# Altium project Rad_hard_git.PrjPcb (part 1 of 2)
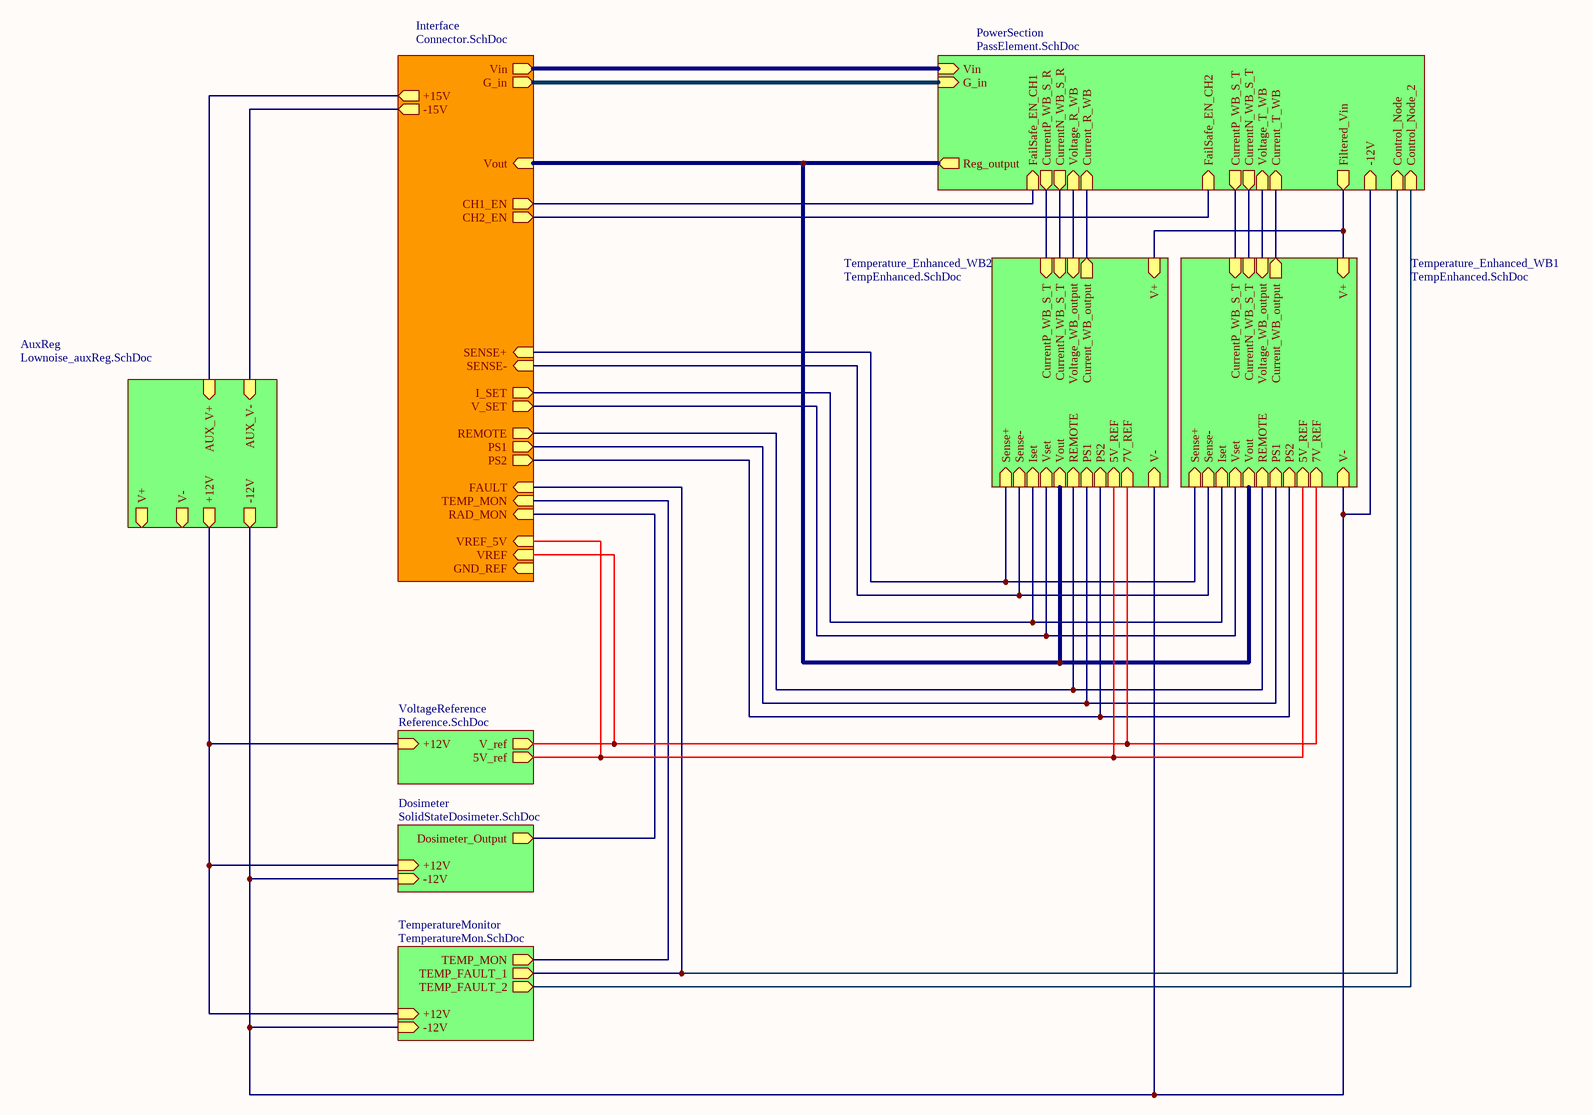
[diagram p0: CoverSchematic.SchDoc]
8 sheets, 183 parts. Net scope: hierarchical (ports join the sheet entries above them; power ports are global).
Board file: radhard.PcbDoc
Sheets:
  CoverSchematic.SchDoc
    Interface = Connector.SchDoc
    PowerSection = PassElement.SchDoc
    VoltageReference = Reference.SchDoc
    Temperature_Enhanced_WB1 = TempEnhanced.SchDoc
    Dosimeter = SolidStateDosimeter.SchDoc
    TemperatureMonitor = TemperatureMon.SchDoc
    AuxReg = Lownoise_auxReg.SchDoc
    Temperature_Enhanced_WB2 = TempEnhanced.SchDoc

## Sheet CoverSchematic.SchDoc
size 431 x 279 mm; SheetNumber: 1; SheetTotal: 8

### Sub-sheets
AuxReg = Lownoise_auxReg.SchDoc: AUX_V+ (in), AUX_V- (in), +12V (out), -12V (out), V+ (out), V- (out)
Dosimeter = SolidStateDosimeter.SchDoc: Dosimeter_Output (out), -12V (in), +12V (in)
Interface = Connector.SchDoc: Vin (out), +15V (out), -15V (out), SENSE- (in), SENSE+ (in), Vout (in), V_SET (out), I_SET (out), CH1_EN (out), CH2_EN (out), FAULT (in), RAD_MON (in), TEMP_MON (in), VREF_5V (in), GND_REF (in), VREF (in), PS2 (out), REMOTE (out), PS1 (out), G_in (out)
PowerSection = PassElement.SchDoc: Vin (in), Reg_output (out), -12V (in), FailSafe_EN_CH1 (in), CurrentP_WB_S_R (out), CurrentN_WB_S_R (out), Voltage_R_WB (in), Current_R_WB (in), FailSafe_EN_CH2 (in), CurrentP_WB_S_T (out), CurrentN_WB_S_T (out), Voltage_T_WB (in), Current_T_WB (in), Filtered_Vin (out), Control_Node (in), Control_Node_2 (in), G_in (in)
Temperature_Enhanced_WB1 = TempEnhanced.SchDoc: V+ (in), V- (in), Voltage_WB_output (in), Current_WB_output (out), CurrentP_WB_S_T (in), CurrentN_WB_S_T (in), Sense+ (in), Sense- (in), Iset (in), Vset (in), 5V_REF (in), 7V_REF (in), Vout (in), REMOTE (in), PS1 (in), PS2 (in)
Temperature_Enhanced_WB2 = TempEnhanced.SchDoc: V+ (in), V- (in), Voltage_WB_output (in), Current_WB_output (out), CurrentP_WB_S_T (in), CurrentN_WB_S_T (in), Sense+ (in), Sense- (in), Iset (in), Vset (in), 5V_REF (in), 7V_REF (in), Vout (in), REMOTE (in), PS1 (in), PS2 (in)
TemperatureMonitor = TemperatureMon.SchDoc: -12V (in), +12V (in), TEMP_FAULT_1 (out), TEMP_MON (out), TEMP_FAULT_2 (out)
VoltageReference = Reference.SchDoc: V_ref (out), 5V_ref (out), +12V (in)

### Nets
Sense+: sheet Interface/SENSE+, sheet Temperature_Enhanced_WB1/Sense+, sheet Temperature_Enhanced_WB2/Sense+
Sense-: sheet Interface/SENSE-, sheet Temperature_Enhanced_WB1/Sense-, sheet Temperature_Enhanced_WB2/Sense-
V+: sheet PowerSection/Filtered_Vin, sheet Temperature_Enhanced_WB1/V+, sheet Temperature_Enhanced_WB2/V+
V-: sheet PowerSection/-12V, sheet Temperature_Enhanced_WB1/V-, sheet Dosimeter/-12V, sheet TemperatureMonitor/-12V, sheet AuxReg/-12V, sheet Temperature_Enhanced_WB2/V-
NetAmph_5: sheet Interface/VREF, sheet VoltageReference/V_ref, sheet Temperature_Enhanced_WB1/7V_REF, sheet Temperature_Enhanced_WB2/7V_REF
NetAmph_7: sheet Interface/VREF_5V, sheet VoltageReference/5V_ref, sheet Temperature_Enhanced_WB1/5V_REF, sheet Temperature_Enhanced_WB2/5V_REF
NetC3_2: sheet Interface/Vout, sheet PowerSection/Reg_output, sheet Temperature_Enhanced_WB1/Vout, sheet Temperature_Enhanced_WB2/Vout
NetC7_2: sheet VoltageReference/+12V, sheet Dosimeter/+12V, sheet TemperatureMonitor/+12V, sheet AuxReg/+12V
NetD1_1: sheet Interface/FAULT, sheet PowerSection/Control_Node, sheet TemperatureMonitor/TEMP_FAULT_1
NetD3_1: sheet Interface/Vin, sheet PowerSection/Vin
NetD5_1: sheet PowerSection/Control_Node_2, sheet TemperatureMonitor/TEMP_FAULT_2
NetD15_1: sheet Interface/+15V, sheet AuxReg/AUX_V+
NetD19_3: sheet Interface/-15V, sheet AuxReg/AUX_V-
NetD27_2: sheet Interface/G_in, sheet PowerSection/G_in
NetJ1_3: sheet Interface/V_SET, sheet Temperature_Enhanced_WB1/Vset, sheet Temperature_Enhanced_WB2/Vset
NetJ1_5: sheet Interface/I_SET, sheet Temperature_Enhanced_WB1/Iset, sheet Temperature_Enhanced_WB2/Iset
NetJ1_8: sheet Interface/CH2_EN, sheet PowerSection/FailSafe_EN_CH2
NetJ1_9: sheet Interface/CH1_EN, sheet PowerSection/FailSafe_EN_CH1
NetJ1_20: sheet Interface/REMOTE, sheet Temperature_Enhanced_WB1/REMOTE, sheet Temperature_Enhanced_WB2/REMOTE
NetJ1_21: sheet Interface/PS1, sheet Temperature_Enhanced_WB1/PS1, sheet Temperature_Enhanced_WB2/PS1
NetJ1_22: sheet Interface/PS2, sheet Temperature_Enhanced_WB1/PS2, sheet Temperature_Enhanced_WB2/PS2
NetJ1_24: sheet Interface/RAD_MON, sheet Dosimeter/Dosimeter_Output
NetJ1_25: sheet Interface/TEMP_MON, sheet TemperatureMonitor/TEMP_MON
NetQ1_3: sheet PowerSection/CurrentP_WB_S_R, sheet Temperature_Enhanced_WB2/CurrentP_WB_S_T
NetQ5_4: sheet PowerSection/CurrentN_WB_S_R, sheet Temperature_Enhanced_WB2/CurrentN_WB_S_T
NetQ6_3: sheet PowerSection/CurrentP_WB_S_T, sheet Temperature_Enhanced_WB1/CurrentP_WB_S_T
NetQ7_4: sheet PowerSection/CurrentN_WB_S_T, sheet Temperature_Enhanced_WB1/CurrentN_WB_S_T
NetR5_1: sheet PowerSection/Current_R_WB, sheet Temperature_Enhanced_WB2/Current_WB_output
NetR6_2: sheet PowerSection/Voltage_R_WB, sheet Temperature_Enhanced_WB2/Voltage_WB_output
NetR13_1: sheet PowerSection/Current_T_WB, sheet Temperature_Enhanced_WB1/Current_WB_output
NetR14_2: sheet PowerSection/Voltage_T_WB, sheet Temperature_Enhanced_WB1/Voltage_WB_output

### Notes on the sheet
- DWG. NO.
- REV.
- SHT.
- THIS DOCUMENT AND THE DATA DISCLOSED HEREIN OR HEREWITH IS THE PROPERTY OF ALTIUM LIMITED AND MAY BE FREELY DISTRIBUTED IN WHOLE. NO RIGHTS ARE RESERVED OR EXPRESS OR IMPLIED WARANTEE GIVEN.
- REVISION
- DESCRIPTION
- DATE
- APPROVED
- TITLE
- PROJECT
- SCALE:
- B
- SIZE
- CAGE CODE
- FILE NAME
- DWG by:
- Heitor Sampaio Mendes
- SHEET
- OF
- REV

## Sheet Connector.SchDoc
size 431 x 279 mm; SheetNumber: 2; SheetTotal: 8
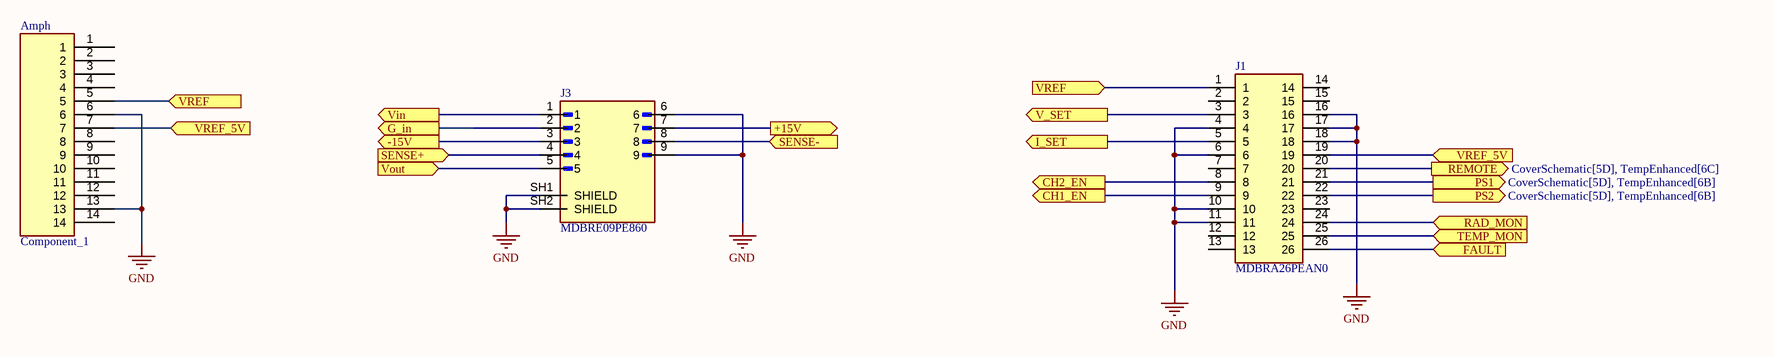
[diagram p1: Connector.SchDoc]

### Parts
Amph  Component_1  [PCBComponent_1]
J1  MDBRA26PEAN0  [MDBRA26PEAN0]
J3  MDBRE09PE860  [AMPHENOL_MDBRE09PE860]

### Ports
+15V (out, see CoverSchematic[6F]), -15V (out, see CoverSchematic[6F]), CH1_EN (out, see CoverSchematic[5E]), CH2_EN (out, see CoverSchematic[5E]), FAULT (in, see CoverSchematic[5D]), G_in (out, see CoverSchematic[5F], PassElement[10D]), I_SET (out, see CoverSchematic[5E]), PS1 (out, see CoverSchematic[5D], TempEnhanced[6B]), PS2 (out, see CoverSchematic[5D], TempEnhanced[6B]), RAD_MON (in, see CoverSchematic[5D]), REMOTE (out, see CoverSchematic[5D], TempEnhanced[6C]), SENSE+ (in, see CoverSchematic[5E], TempEnhanced[8D]), SENSE- (in, see CoverSchematic[5E], TempEnhanced[8D]), TEMP_MON (in, see CoverSchematic[5D], TemperatureMon[4E]), V_SET (out, see CoverSchematic[5E]), Vin (out, see CoverSchematic[5F], PassElement[10E]), Vout (in, see CoverSchematic[5F], TempEnhanced[5C]), VREF (in, see CoverSchematic[5D]), VREF_5V (in, see CoverSchematic[5D])

### Nets
GND: Amph.6 Amph.13 J1.4 J1.6 J1.10 J1.11 J1.16 J1.17 J1.18 J3.6 J3.9 J3.SH1(SHIELD) J3.SH2(SHIELD)
Sense+: J3.4 ; port SENSE+
Sense-: J3.8 ; port SENSE-
NetAmph_5: Amph.5 J1.1 ; port VREF
NetAmph_7: Amph.7 J1.19 ; port VREF_5V
NetC3_2: J3.5 ; port Vout
NetD1_1: J1.26 ; port FAULT
NetD3_1: J3.1 ; port Vin
NetD15_1: J3.7 ; port +15V
NetD19_3: J3.3 ; port -15V
NetD27_2: J3.2 ; port G_in
NetJ1_3: J1.3 ; port V_SET
NetJ1_5: J1.5 ; port I_SET
NetJ1_8: J1.8 ; port CH2_EN
NetJ1_9: J1.9 ; port CH1_EN
NetJ1_20: J1.20 ; port REMOTE
NetJ1_21: J1.21 ; port PS1
NetJ1_22: J1.22 ; port PS2
NetJ1_24: J1.24 ; port RAD_MON
NetJ1_25: J1.25 ; port TEMP_MON

Not connected (* = marked no-connect by the designer): Amph 1 2 3 4 8 9 10 11 12 14; J1 2 7 12 13 14 15 23

### Notes on the sheet
- DWG. NO.
- REV.
- SHT.
- THIS DOCUMENT AND THE DATA DISCLOSED HEREIN OR HEREWITH IS THE PROPERTY OF ALTIUM LIMITED AND MAY BE FREELY DISTRIBUTED IN WHOLE. NO RIGHTS ARE RESERVED OR EXPRESS OR IMPLIED WARANTEE GIVEN.
- REVISION
- DESCRIPTION
- DATE
- APPROVED
- TITLE
- PROJECT
- SCALE:
- B
- SIZE
- CAGE CODE
- FILE NAME
- DWG by:
- Heitor Sampaio Mendes
- SHEET
- OF
- REV

### Library data of the parts
Amph = ACRK-16-01-G-T-B1-M-1
J1 = MDBRA26PEAN0: Connector; Manufacturer_Name: Amphenol Communications Solutions; Datasheet Link: https://cdn.amphenol-cs.com/media/wysiwyg/files/documentation/datasheet/inputoutput/io_harsh_mdbr.pdf; Height: 15.18mm; Manufacturer_Part_Number: MDBRA26PEAN0; Mouser Part Number: 523-MDBRA26PEAN0; Mouser Price/Stock: https://www.mouser.co.uk/ProductDetail/Amphenol-Commercial-Products/MDBRA26PEAN0?qs=ToP8pWlZ0bMfgHuNRziKHA%3D%3D
J3 = MDBRE09PE860: MF: {'manufacturer': u'Amphenol Commercial Products'}; Package: None; Price: None; Value: *; MP: MDBRE09PE860; Availability: Unavailable

## Sheet PassElement.SchDoc
size 558 x 431 mm; SheetNumber: 5; SheetTotal: 8
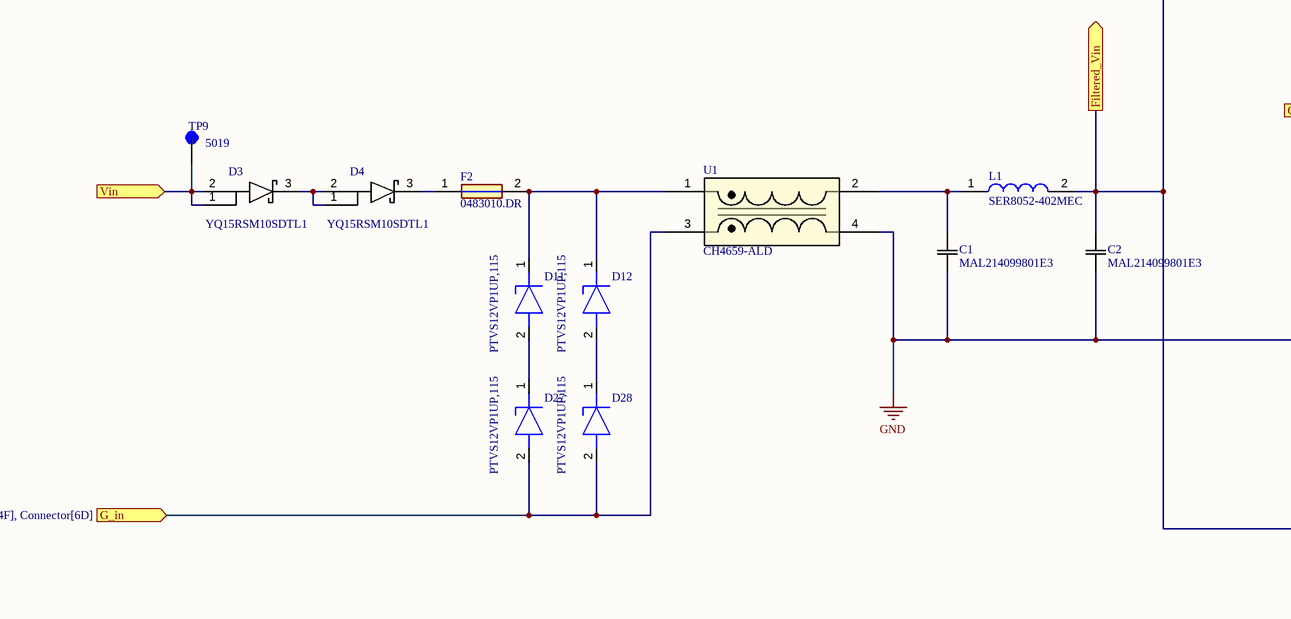
[diagram p2: PassElement.SchDoc, left]
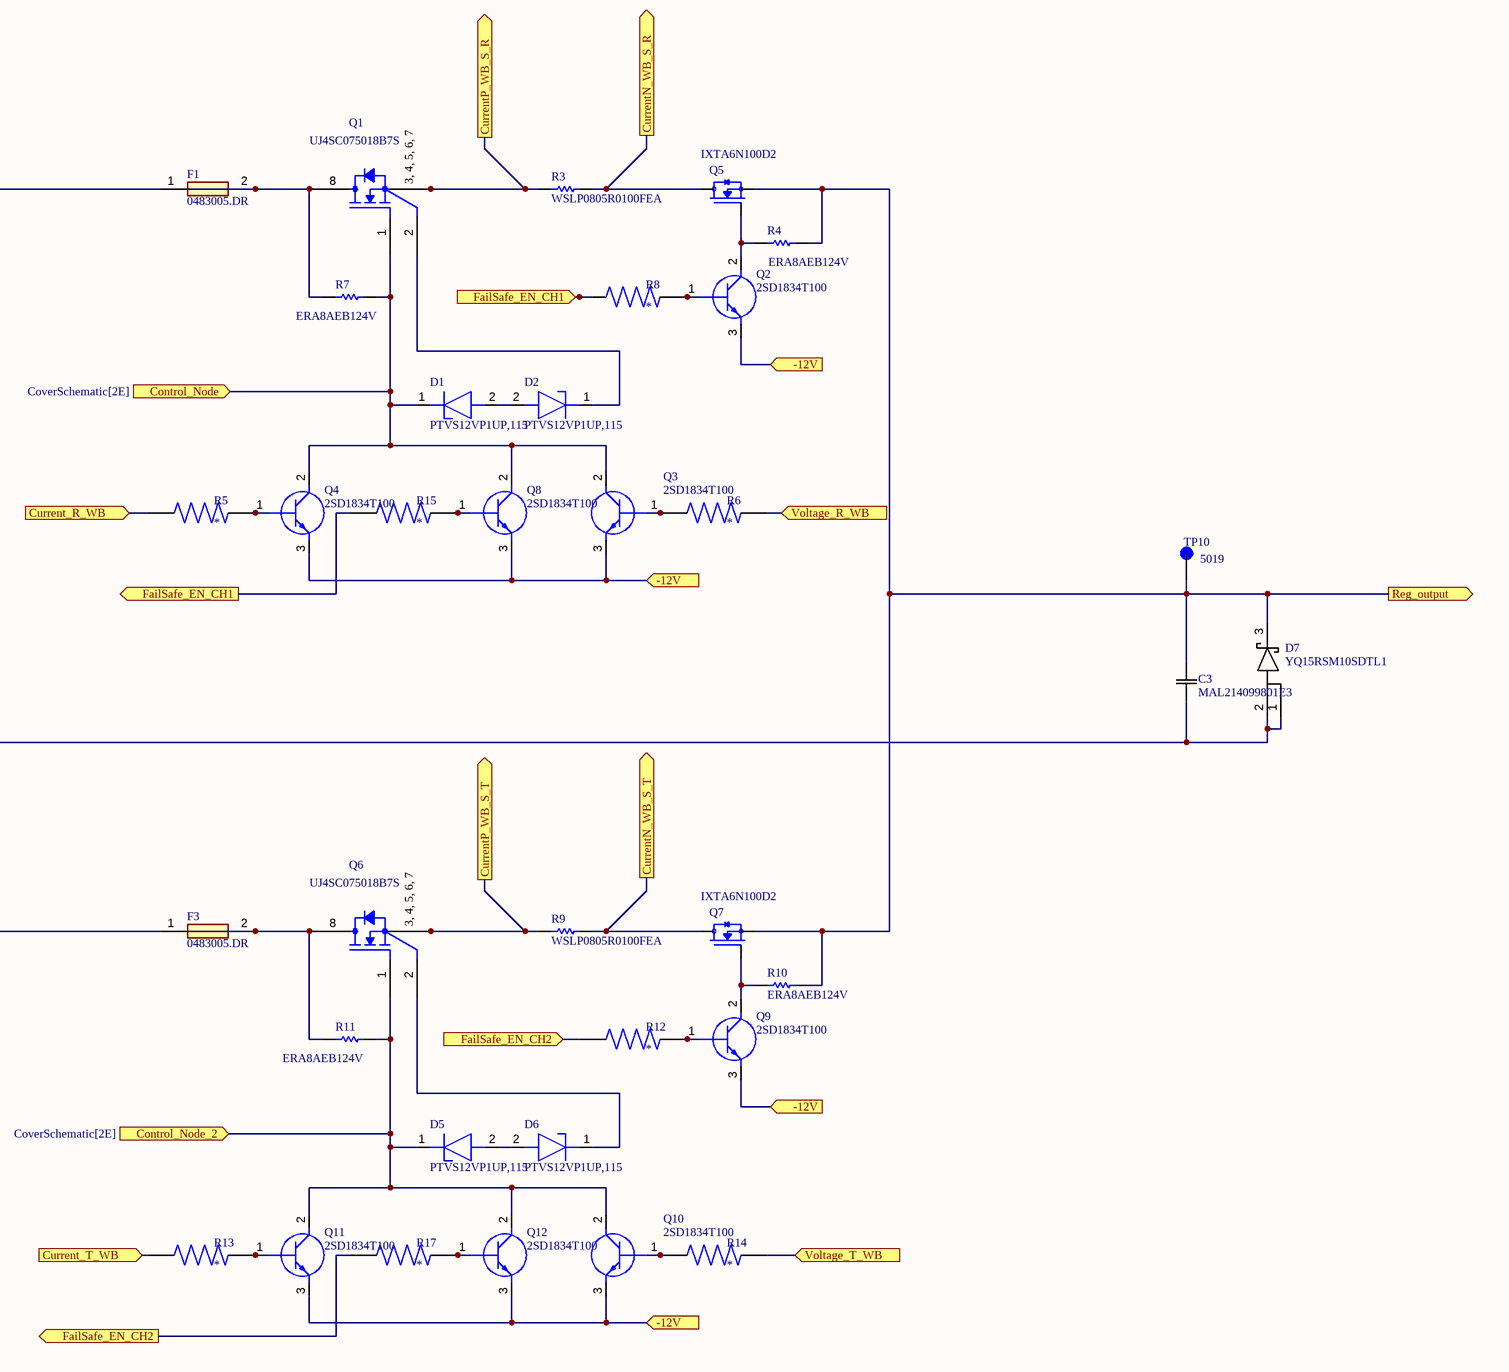
[diagram p3: PassElement.SchDoc, right]

### Parts
C1  MAL214099801E3  [CAP_140CRH_1010_VIS]
C2  MAL214099801E3  [CAP_140CRH_1010_VIS]
C3  MAL214099801E3  [CAP_140CRH_1010_VIS]
D1  PTVS12VP1UP,115  [PMEG3050EP115]
D2  PTVS12VP1UP,115  [PMEG3050EP115]
D3  YQ15RSM10SDTL1  [YQ15RSM10SDTL1]
D4  YQ15RSM10SDTL1  [YQ15RSM10SDTL1]
D5  PTVS12VP1UP,115  [PMEG3050EP115]
D6  PTVS12VP1UP,115  [PMEG3050EP115]
D7  YQ15RSM10SDTL1  [YQ15RSM10SDTL1]
D11  PTVS12VP1UP,115  [PMEG3050EP115]
D12  PTVS12VP1UP,115  [PMEG3050EP115]
D27  PTVS12VP1UP,115  [PMEG3050EP115]
D28  PTVS12VP1UP,115  [PMEG3050EP115]
F1  0483005.DR  [FUSC3316X137N]
F2  0483010.DR  [FUSC3316X137N]
F3  0483005.DR  [FUSC3316X137N]
L1  SER8052-402MEC  [SER8052402MEC]
Q1  UJ4SC075018B7S  [UJ4SC075018B7S]
Q2  2SD1834T100  [RJP020N06]
Q3  2SD1834T100  [RJP020N06]
Q4  2SD1834T100  [RJP020N06]
Q5  IXTA6N100D2  [DPAK254P1524X483-3N]
Q6  UJ4SC075018B7S  [UJ4SC075018B7S]
Q7  IXTA6N100D2  [DPAK254P1524X483-3N]
Q8  2SD1834T100  [RJP020N06]
Q9  2SD1834T100  [RJP020N06]
Q10  2SD1834T100  [RJP020N06]
Q11  2SD1834T100  [RJP020N06]
Q12  2SD1834T100  [RJP020N06]
R3  WSLP0805R0100FEA  [RESC2013X58X38LL25T25]
R4  ERA8AEB124V  [RESC3216X70X50LL20T25]
R5  MCT06030C1001FP500  [RESC1508X55N]  (value not drawn)
R6  MCT06030C1001FP500  [RESC1508X55N]  (value not drawn)
R7  ERA8AEB124V  [RESC3216X70X50LL20T25]
R8  MCT06030C1001FP500  [RESC1508X55N]  (value not drawn)
R9  WSLP0805R0100FEA  [RESC2013X58X38LL25T25]
R10  ERA8AEB124V  [RESC3216X70X50LL20T25]
R11  ERA8AEB124V  [RESC3216X70X50LL20T25]
R12  MCT06030C1001FP500  [RESC1508X55N]  (value not drawn)
R13  MCT06030C1001FP500  [RESC1508X55N]  (value not drawn)
R14  MCT06030C1001FP500  [RESC1508X55N]  (value not drawn)
R15  MCT06030C1001FP500  [RESC1508X55N]  (value not drawn)
R17  MCT06030C1001FP500  [RESC1508X55N]  (value not drawn)
TP9  5019  [KEYSTONE_5019]
TP10  5019  [KEYSTONE_5019]
U1  CH4659-ALD  [CH4659-ALD_COC]

### Ports
-12V (in, see CoverSchematic[3E], Lownoise_auxReg[2C], SolidStateDosimeter[5B], TemperatureMon[3D], TemperatureMon[3E], TemperatureMon[6D]), Control_Node (in, see CoverSchematic[2E]), Control_Node_2 (in, see CoverSchematic[2E]), Current_R_WB (in, see CoverSchematic[4E]), Current_T_WB (in, see CoverSchematic[3E]), CurrentN_WB_S_R (out, see CoverSchematic[4E]), CurrentN_WB_S_T (out, see CoverSchematic[3E], TempEnhanced[8F]), CurrentP_WB_S_R (out, see CoverSchematic[4E]), CurrentP_WB_S_T (out, see CoverSchematic[3E], TempEnhanced[8F]), FailSafe_EN_CH1 (in, see CoverSchematic[4E]), FailSafe_EN_CH1 (out, see CoverSchematic[4E]), FailSafe_EN_CH2 (in, see CoverSchematic[3E]), FailSafe_EN_CH2 (out, see CoverSchematic[3E]), Filtered_Vin (out, see CoverSchematic[3E]), G_in (in, see CoverSchematic[4F], Connector[6D]), Reg_output (out, see CoverSchematic[4F]), Vin (in, see CoverSchematic[4F], Connector[6D]), Voltage_R_WB (in, see CoverSchematic[4E]), Voltage_T_WB (in, see CoverSchematic[3E])

### Nets
GND: C1.1 C2.1 C3.1 D7.1(A1) D7.2(A2) U1.4
V+: C2.2 F1.1 F3.1 L1.2 ; port Filtered_Vin
V-: Q2.3(E) Q3.3(E) Q4.3(E) Q8.3(E) Q9.3(E) Q10.3(E) Q11.3(E) Q12.3(E) ; port -12V
NetC1_2: C1.2 L1.1 U1.2
NetC3_2: C3.2 D7.3(K) Q5.3(S) Q7.3(S) R4.2 R10.2 TP10.TP ; port Reg_output
NetD1_1: D1.1(K) Q1.1 Q3.2(C) Q4.2(C) Q8.2(C) R7.2 ; port Control_Node
NetD1_2: D1.2(A) D2.2(A)
NetD2_1: D2.1(K) Q1.2
NetD3_1: D3.1(A1) D3.2(A2) TP9.TP ; port Vin
NetD3_3: D3.3(K) D4.1(A1) D4.2(A2)
NetD4_3: D4.3(K) F2.1
NetD5_1: D5.1(K) Q6.1 Q10.2(C) Q11.2(C) Q12.2(C) R11.2 ; port Control_Node_2
NetD5_2: D5.2(A) D6.2(A)
NetD6_1: D6.1(K) Q6.2
NetD11_1: D11.1(K) D12.1(K) F2.2 U1.1
NetD11_2: D11.2(A) D27.1(K)
NetD12_2: D12.2(A) D28.1(K)
NetD27_2: D27.2(A) D28.2(A) U1.3 ; port G_in
NetF1_2: F1.2 Q1.8 R7.1
NetF3_2: F3.2 Q6.8 R11.1
NetJ1_8: R12.1 R17.1 ; port FailSafe_EN_CH2
NetJ1_9: R8.1 R15.1 ; port FailSafe_EN_CH1
NetQ1_3: Q1.3 Q1.4 Q1.5 Q1.6 Q1.7 R3.1 ; port CurrentP_WB_S_R
NetQ2_1: Q2.1(B) R8.2
NetQ2_2: Q2.2(C) Q5.1(G) R4.1
NetQ3_1: Q3.1(B) R6.1
NetQ4_1: Q4.1(B) R5.2
NetQ5_4: Q5.4(D) R3.2 ; port CurrentN_WB_S_R
NetQ6_3: Q6.3 Q6.4 Q6.5 Q6.6 Q6.7 R9.1 ; port CurrentP_WB_S_T
NetQ7_1: Q7.1(G) Q9.2(C) R10.1
NetQ7_4: Q7.4(D) R9.2 ; port CurrentN_WB_S_T
NetQ8_1: Q8.1(B) R15.2
NetQ9_1: Q9.1(B) R12.2
NetQ10_1: Q10.1(B) R14.1
NetQ11_1: Q11.1(B) R13.2
NetQ12_1: Q12.1(B) R17.2
NetR5_1: R5.1 ; port Current_R_WB
NetR6_2: R6.2 ; port Voltage_R_WB
NetR13_1: R13.1 ; port Current_T_WB
NetR14_2: R14.2 ; port Voltage_T_WB

Not connected (* = marked no-connect by the designer): L1 3

### Notes on the sheet
- DWG. NO.
- REV.
- SHT.
- REVISION
- DESCRIPTION
- DATE
- APPROVED
- THIS DOCUMENT AND THE DATA DISCLOSED HEREIN OR HEREWITH IS THE PROPERTY OF ALTIUM LIMITED AND MAY BE FREELY DISTRIBUTED IN WHOLE. NO RIGHTS ARE RESERVED OR EXPRESS OR IMPLIED WARANTEE GIVEN.
- PROJECT
- TITLE
- SCALE:
- C
- SIZE
- CAGE CODE
- FILE NAME
- DWG by:
- Heitor Sampaio Mendes
- SHEET
- OF
- REV
- (in symbol UJ4SC075018B7S) 3, 4, 5, 6, 7

### Library data of the parts
C1-C3 = MAL214099801E3: No Description Available; Mfr_Name: Vishay
D1 D2 D5 D6 D11 D12 D27 D28 = PTVS12VP1UP,115: Diode ESD (Uni-directional); Manufacturer_Name: Nexperia; Datasheet Link: https://assets.nexperia.com/documents/data-sheet/PTVSXP1UP_SER.pdf; Height: 1mm; Manufacturer_Part_Number: PTVS12VP1UP,115; Mouser Part Number: 771-PTVS12VP1UP115; Mouser Price/Stock: https://www.mouser.co.uk/ProductDetail/Nexperia/PTVS12VP1UP115?qs=5eMHoInnifTeU9%2FVxPGuCA%3D%3D; Arrow Part Number: PTVS12VP1UP,115; Arrow Price/Stock: https://www.arrow.com/en/products/ptvs12vp1up115/nexperia
D3 D4 D7 = YQ15RSM10SDTL1: Schottky Diode; Manufacturer_Name: ROHM Semiconductor; Datasheet Link: https://fscdn.rohm.com/en/products/databook/datasheet/discrete/diode/schottky_barrier/yq15rsm10sdtl1-e.pdf; Height: 1.2mm; Manufacturer_Part_Number: YQ15RSM10SDTL1; Mouser Part Number: 755-YQ15RSM10SDTL1; Mouser Price/Stock: https://www.mouser.co.uk/ProductDetail/ROHM-Semiconductor/YQ15RSM10SDTL1?qs=Z%252BL2brAPG1JP7erh913hZg%3D%3D
F1 F3 = 0483005.DR: Fuse; Manufacturer_Name: LITTELFUSE; Datasheet Link: https://cdn1-originals.webdamdb.com/12956_149052564?cache=1683183235&response-content-disposition=inline;filename=Littelfuse_Fuse_483A.pdf&response-content-type=application/pdf&Policy=eyJTdGF0ZW1lbnQiOlt7IlJlc291cmNlIjoiaHR0cCo6Ly9jZG4xLW9yaWdpbmFscy53ZWJ; Height: 1.371mm; Manufacturer_Part_Number: 0483005.DR; Mouser Part Number: 576-0483005.DR; Mouser Price/Stock: https://www.mouser.co.uk/ProductDetail/Littelfuse/0483005.DR?qs=%252BEew9%252B0nqrAp%252B2CptGC9xg%3D%3D
F2 = 0483010.DR: Fuse; Manufacturer_Name: LITTELFUSE; Datasheet Link: https://www.littelfuse.com/media?resourcetype=datasheets&itemid=c0438919-6934-484b-af98-072ed2079425&filename=littelfuse-fuse-483a; Height: 1.371mm; Manufacturer_Part_Number: 0483010.DR
L1 = SER8052-402MEC: Inductor; Manufacturer_Name: COILCRAFT; Datasheet Link: https://www.coilcraft.com/getmedia/f704c02a-b3a0-4aab-a2f9-03662c81c40d/ser80xx.pdf; Height: 5.2mm; Manufacturer_Part_Number: SER8052-402MEC; Mouser Part Number: 994-SER8052-402MEC; Mouser Price/Stock: https://www.mouser.co.uk/ProductDetail/Coilcraft/SER8052-402MEC?qs=mBwMfv9Clf3lT8OdMPOqNQ%3D%3D
Q1 Q6 = UJ4SC075018B7S: MOSFET 750V/18mO,SICFET,G4,TO263-7; ComponentLink1Description: New link; ComponentLink1URL: *
Q2-Q4 Q8-Q12 = 2SD1834T100: Transistor BJT NPN; Manufacturer_Name: ROHM Semiconductor; Datasheet Link: https://fscdn.rohm.com/en/products/databook/datasheet/discrete/transistor/bipolar/2sd1834t100-e.pdf; Height: 1.45mm; Manufacturer_Part_Number: 2SD1834T100; Mouser Part Number: 755-2SD1834T100; Mouser Price/Stock: https://www.mouser.co.uk/ProductDetail/ROHM-Semiconductor/2SD1834T100?qs=4kLU8WoGk0vMh1jN%252BYQmXQ%3D%3D
Q5 Q7 = IXTA6N100D2: N-Channel 1000 V 6 A 2.2 Ohm SMT Depletion Mode Power Mosfet - D2PAK; MF: {'manufacturer': u'IXYS'}; Package: None; Price: None; Value: *; MP: IXTA6N100D2; Availability: Unavailable
R3 R9 = CMP-2001-04321-1: Manufacturer: Vishay Dale; Part Number: WSLP0805R0100FEA
R4 R7 R10 R11 = CMP-2003-04417-1: Manufacturer: Panasonic; Part Number: ERA8AEB124V
R5 R6 R8 R12-R15 R17 = MCT06030C1001FP500: Res Thin Film 0603 1K Ohm 1% 0.1W(1/10W) ?50ppm/C Molded SMD Automotive Medical T/R; MF: {'manufacturer': u'Vishay Beyschlag'}; Value: *; Package: None; Price: None; MP: MCT06030C1001FP500; Availability: Unavailable
TP9 TP10 = 5019: MF: {'manufacturer': u'Keystone Electronics'}; Package: None; Price: None; Value: *; MP: 5019; Availability: Unavailable
U1 = CH4659-ALD: No Description Available; Mfr_Name: Coilcraft; RefDes: RefDes; Type: Type

## Sheet Reference.SchDoc: Ultrastable Reference
size 558 x 431 mm; SheetNumber: 3; SheetTotal: 8
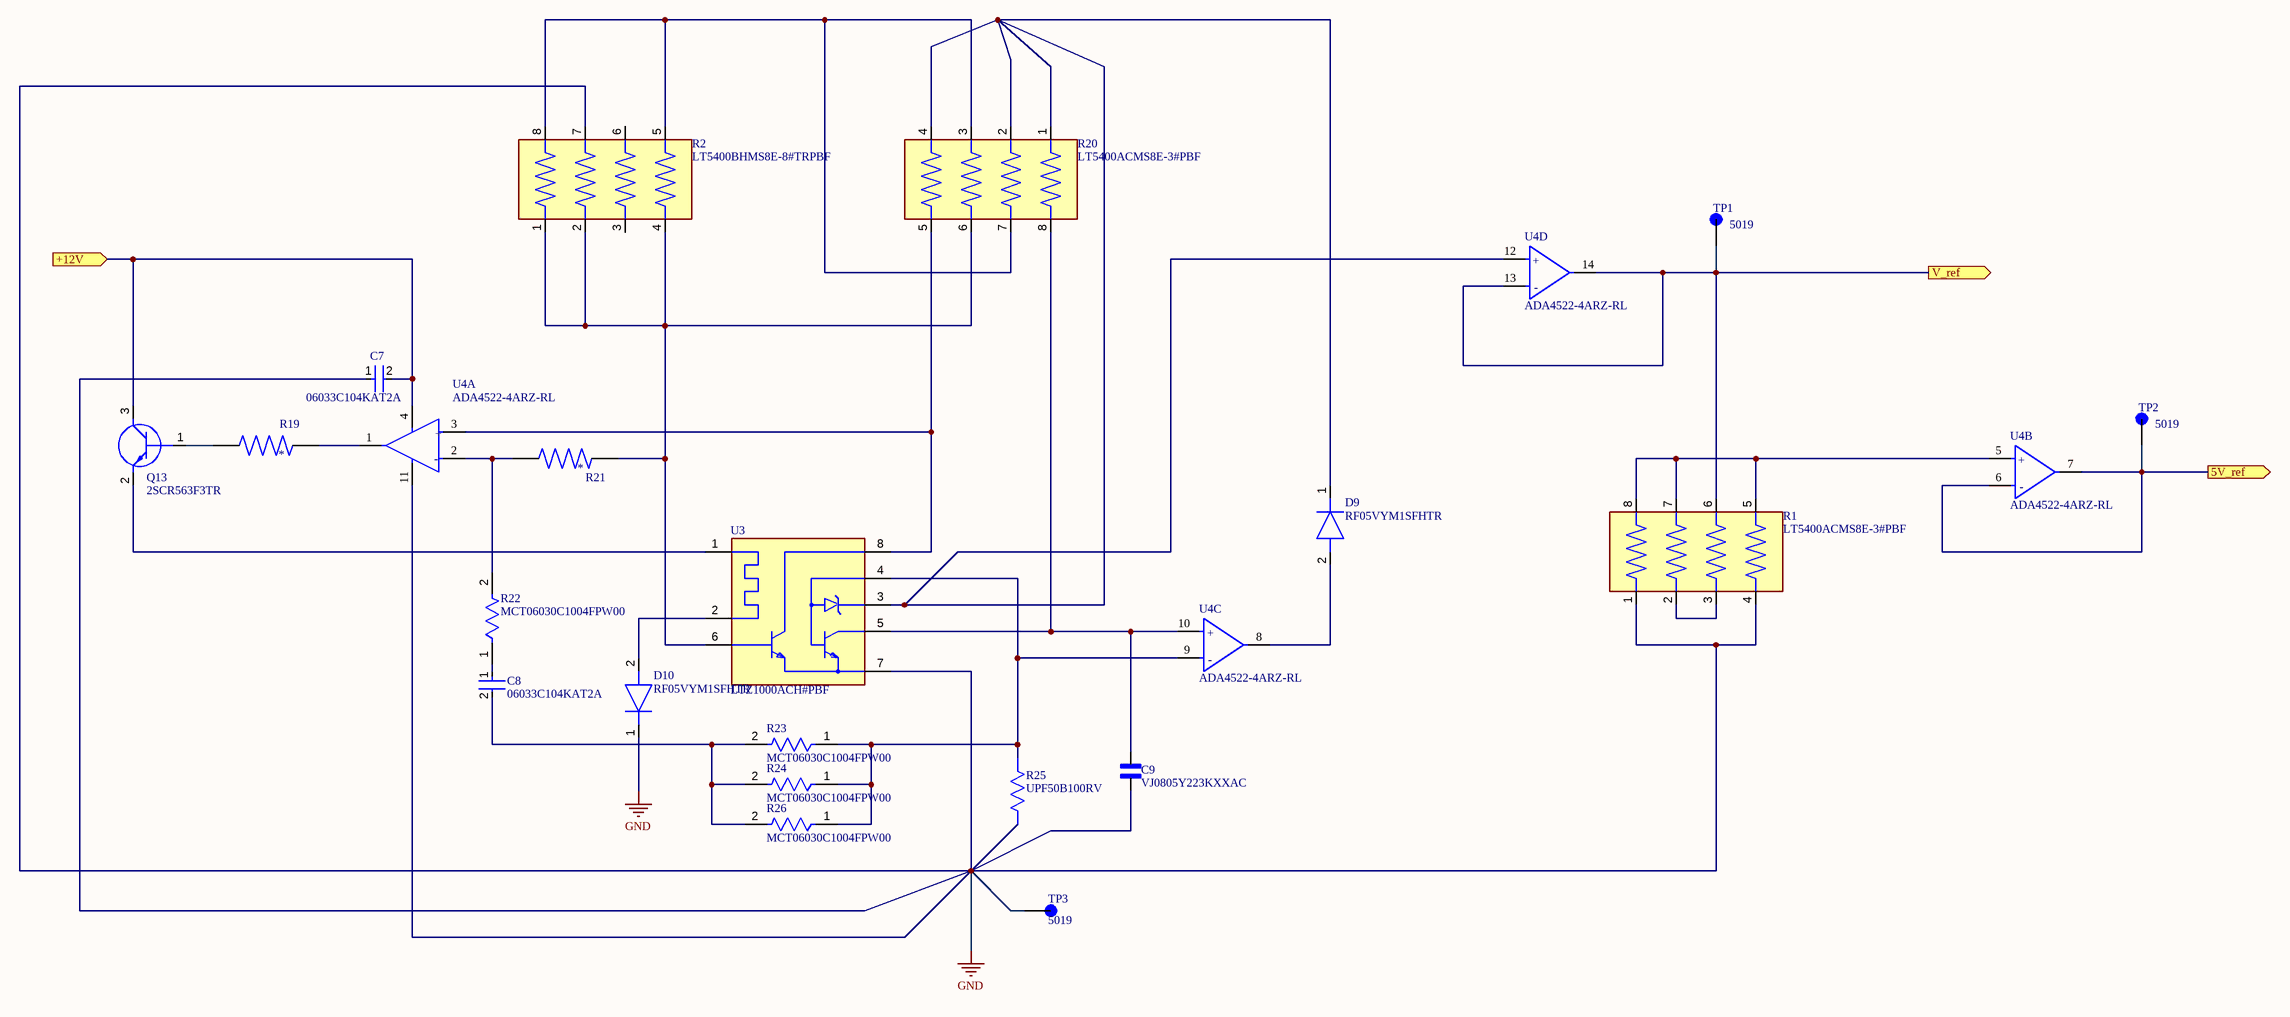
[diagram p4: Reference.SchDoc]

### Parts
C7  06033C104KAT2A  [FP-0603-L_1_6_0_15-W_0_81-MFG]
C8  06033C104KAT2A  [FP-0603-L_1_6_0_15-W_0_81-MFG]
C9  VJ0805Y223KXXAC  [CAPC2012X145N]
D9  RF05VYM1SFHTR  [RF05VYM1SFHTR]
D10  RF05VYM1SFHTR  [RF05VYM1SFHTR]
Q13  2SCR563F3TR  [2SAR542F3]
R1  LT5400ACMS8E-3#PBF  [SOP65P490X110-9N]
R2  LT5400BHMS8E-8#TRPBF  [SOP65P490X110-9N]
R19  MCT06030C1001FP500  [RESC1508X55N]  (value not drawn)
R20  LT5400ACMS8E-3#PBF  [SOP65P490X110-9N]
R21  MCT06030C1001FP500  [RESC1508X55N]  (value not drawn)
R22  MCT06030C1004FPW00  [FP-MCT0603-MFG]
R23  MCT06030C1004FPW00  [FP-MCT0603-MFG]
R24  MCT06030C1004FPW00  [FP-MCT0603-MFG]
R25  UPF50B100RV  [RES_UPF50B2K0V_TEC]
R26  MCT06030C1004FPW00  [FP-MCT0603-MFG]
TP1  5019  [KEYSTONE_5019]
TP2  5019  [KEYSTONE_5019]
TP3  5019  [KEYSTONE_5019]
U3  LTZ1000ACH#PBF  [FP-H-8-05-08-1320-MFG]
U4  ADA4522-4ARZ-RL  [FP-R-14-IPC_C]  (parts A,B,C,D of 4)

### Ports
5V_ref (out, see CoverSchematic[5C], TempEnhanced[5D], TempEnhanced[5F]), +12V (in, see CoverSchematic[6C], Lownoise_auxReg[4D], SolidStateDosimeter[5C], TemperatureMon[5D], TemperatureMon[6E], TemperatureMon[8D]), V_ref (out, see CoverSchematic[5C])

### Nets
GND: C7.1 C9.1 D10.1(K) R1.1 R1.4 R2.7 R25.1 TP3.TP U3.7(E) U4.11(V-)
NetAmph_5: R1.6 TP1.TP U4.13(-IN_D) U4.14(OUT_D) ; port V_ref
NetAmph_7: TP2.TP U4.6(-IN_B) U4.7(OUT_B) ; port 5V_ref
NetC7_2: C7.2 Q13.3(C) U4.4(V+) ; port +12V
NetC8_1: C8.1 R22.1
NetC8_2: C8.2 R23.2 R24.2 R26.2
NetC9_2: C9.2 R20.8 U3.5(C) U4.10(+IN_C)
NetD9_1: D9.1(K) R20.1 R20.2 R20.4 U3.3(ZENER+) U4.12(+IN_D)
NetD9_2: D9.2(A) U4.8(OUT_C)
NetD10_2: D10.2(A) U3.2(HEATER-)
NetQ13_1: Q13.1(B) R19.1
NetQ13_2: Q13.2(E) U3.1(HEATER+)
NetR1_2: R1.2 R1.3
NetR1_5: R1.5 R1.7 R1.8 U4.5(+IN_B)
NetR2_1: R2.1 R2.2 R2.4 R20.6 R21.2 U3.6(B)
NetR2_5: R2.5 R2.8 R20.3 R20.7
NetR19_2: R19.2 U4.1(OUT_A)
NetR20_5: R20.5 U3.8(C) U4.3(+IN_A)
NetR21_1: R21.1 R22.2 U4.2(-IN_A)
NetR23_1: R23.1 R24.1 R25.2 R26.1 U3.4(SUBSTRATE/ZENER-) U4.9(-IN_C)

Not connected (* = marked no-connect by the designer): Q13 4(C_2); R2 3 6

### Notes on the sheet
- DWG. NO.
- REV.
- SHT.
- REVISION
- DESCRIPTION
- DATE
- APPROVED
- THIS DOCUMENT AND THE DATA DISCLOSED HEREIN OR HEREWITH IS THE PROPERTY OF ALTIUM LIMITED AND MAY BE FREELY DISTRIBUTED IN WHOLE. NO RIGHTS ARE RESERVED OR EXPRESS OR IMPLIED WARANTEE GIVEN.
- PROJECT
- TITLE
- SCALE:
- C
- SIZE
- CAGE CODE
- FILE NAME
- DWG by:
- Heitor Sampaio Mendes
- SHEET
- OF
- REV
- (in symbol CMP-09116-000280-1, part A) +; -
- (in symbol CMP-09116-000280-1, part B) +; -
- (in symbol CMP-09116-000280-1, part C) +; -
- (in symbol CMP-09116-000280-1, part D) +; -

### Library data of the parts
C7 C8 = CMP-2006-04157-2: General Purpose Ceramic Capacitor, 0603, 100nF, 10%, X7R, 15%, 25V; Termination: SMD/SMT; Voltage Rating: 25V; Mount: Surface Mount; Number of Pins: 2; Contact Plating: Tin; Case Code (Imperial): 0603; Construction: Flat; Max Operating Temperature: 125°C; Voltage: 25V; Height: 0.9mm; Thickness: 0.035inch; Case Code (Metric): 1608; Case/Package: 0603; Capacitance: 100nF; Length: 1.6mm; Dielectric: X7R; Width: 0.032inch; Series: -; Min Operating Temperature: -55°C; Package Quantity: 4000; REACH SVHC: No SVHC; RoHS Compliant: Yes; Voltage Rating (DC): 25V; Depth: 0.81mm; Packaging: Tape and Reel; Lead Free: Lead Free; Radiation Hardening: No; Tolerance: 10%
C9 = VJ0805Y223KXXAC: MF: {'manufacturer': u'Vishay Vitramon'}; Package: None; Price: None; Value: *; MP: VJ0805Y223KXXAC; Availability: Unavailable
D9 D10 = RF05VYM1SFHTR: Diode; Manufacturer_Name: ROHM Semiconductor; Datasheet Link: https://fscdn.rohm.com/en/products/databook/datasheet/discrete/diode/fast_recovery/rf05vym1sfh.pdf; Height: 0.8mm; Manufacturer_Part_Number: RF05VYM1SFHTR; Mouser Part Number: 755-RF05VYM1SFHTR; Mouser Price/Stock: https://www.mouser.co.uk/ProductDetail/ROHM-Semiconductor/RF05VYM1SFHTR?qs=4v%252BiZTmLVHEBI5apodawUw%3D%3D
Q13 = 2SCR563F3TR: Transistor BJT NPN; Manufacturer_Name: ROHM Semiconductor; Datasheet Link: https://fscdn.rohm.com/en/products/databook/datasheet/discrete/transistor/bipolar/2scr563f3tr-e.pdf; Height: 0.6mm; Manufacturer_Part_Number: 2SCR563F3TR; Mouser Part Number: 755-2SCR563F3TR; Mouser Price/Stock: https://www.mouser.co.uk/ProductDetail/ROHM-Semiconductor/2SCR563F3TR?qs=QNEnbhJQKva43loT1EhzlQ%3D%3D
R1 R20 = LT5400ACMS8E-3#PBF: 1k, 9k Ohm Â±15% 800mW Power Per Element Isolated Resistor Network/Array Â±25ppm/Â°C 8-TSSOP, 8-MSOP (0.118", 3.00mm Width) Exposed Pad; MF: {'manufacturer': u'Analog Devices'}; Package: None; Price: None; Value: *; MP: LT5400ACMS8E-3#PBF; Availability: Unavailable
R2 = LT5400BHMS8E-8#TRPBF: 1k, 9k Ohm Â±15% 800mW Power Per Element Isolated Resistor Network/Array Â±25ppm/Â°C 8-TSSOP, 8-MSOP (0.118", 3.00mm Width) Exposed Pad; MF: {'manufacturer': u'Analog Devices'}; Package: None; Price: None; Value: *; MP: LT5400BHMS8E-8#TRPBF; Availability: Unavailable
R19 R21 = MCT06030C1001FP500: as R5 on sheet PassElement; Value: *; Package: None; Price: None; MP: MCT06030C1001FP500; Availability: Unavailable
R22-R24 R26 = CMP-02407-007592-1: RES SMD 100 OHM 1% 1/8W 0603; Resistance: 1MR; Military Standard: Not; Lead Free: Lead Free; Max Operating Temperature: 125°C; Tolerance: 1%; Min Operating Temperature: -55°C; Length: 1.55mm; Case/Package: 0603; Packaging: Tape and Reel; Composition: Thin Film; Depth: 0.85mm
R25 = UPF50B100RV: No Description Available; Mfr_Name: TE Connectivity
TP1-TP3 = 5019: as TP9 on sheet PassElement; Package: None; Price: None; Value: *; MP: 5019; Availability: Unavailable
U3 = CMP-09137-000002-1: IC VREF SHUNT 7.2V TO5; Manufacturer: Analog Devices; Number Of Outputs: 1; Output Type: Fixed; Standoff Height: 0.254mm; Reference Type: Buried Zener; Max Junction Temp: +150°C; Octopart: https://octopart.com/ltz1000ach%23pbf-analog+devices-88320833; Temperature Range High: +125°C; Height: 5.969mm; Temperature Range Low: -55°C; ComponentLink2URL: https://www.analog.com/media/en/technical-documentation/data-sheets/LTZ1000.pdf; Digikey Description: IC VREF SHUNT 7.2V TO5; ComponentLink2Description: Datasheet; Ambient Temperature Range High: +125°C; Ambient Temperature Range Low: -55°C; Automotive: No; RoHS: TRUE; Device Class L1: Integrated Circuits (ICs); Package: H-8-05-08-1320; Device Class L2: Power Management ICs; Device Class L3: Voltage References; Manufacturer Part Number: LTZ1000ACH#PBF; Category: IC; Lead Free: Yes; Temperature: -55°C to +125°C
U4 = CMP-09116-000280-1: IC OPAMP ZERO-DRIFT 4CIRC 14SOIC; Min Supply Voltage: 4.5V; Operating Supply Current: 830uA; Input Bias Current: 50pA; Number of Circuits: 4; Common Mode Rejection Ratio: 140dB; Output Current per Channel: 32mA; Slew Rate: 1.7V/µs; Power Supply Rejection Ratio (PSRR): 150dB; Input Offset Voltage (Vos): 1.5uV; Min Dual Supply Voltage: 2.25V; Max Supply Voltage: 55V; Gain Bandwidth Product: 2.7MHz; Max Dual Supply Voltage: 27.5V; Voltage Gain: 137dB; Max Operating Temperature: 125°C; Number of Pins: 14; Case/Package: SOIC; RoHS Compliant: Yes; Packaging: Tape and Reel; Min Operating Temperature: -40°C; Contact Plating: Tin; Lead Free: Contains Lead; Mount: Surface Mount

## Sheet TempEnhanced.SchDoc
size 558 x 431 mm; SheetNumber: 4; SheetTotal: 8
Used 2 times, as channels Temperature_Enhanced_WB1, Temperature_Enhanced_WB2. Parts and nets are listed once, with the designators drawn on the sheet.
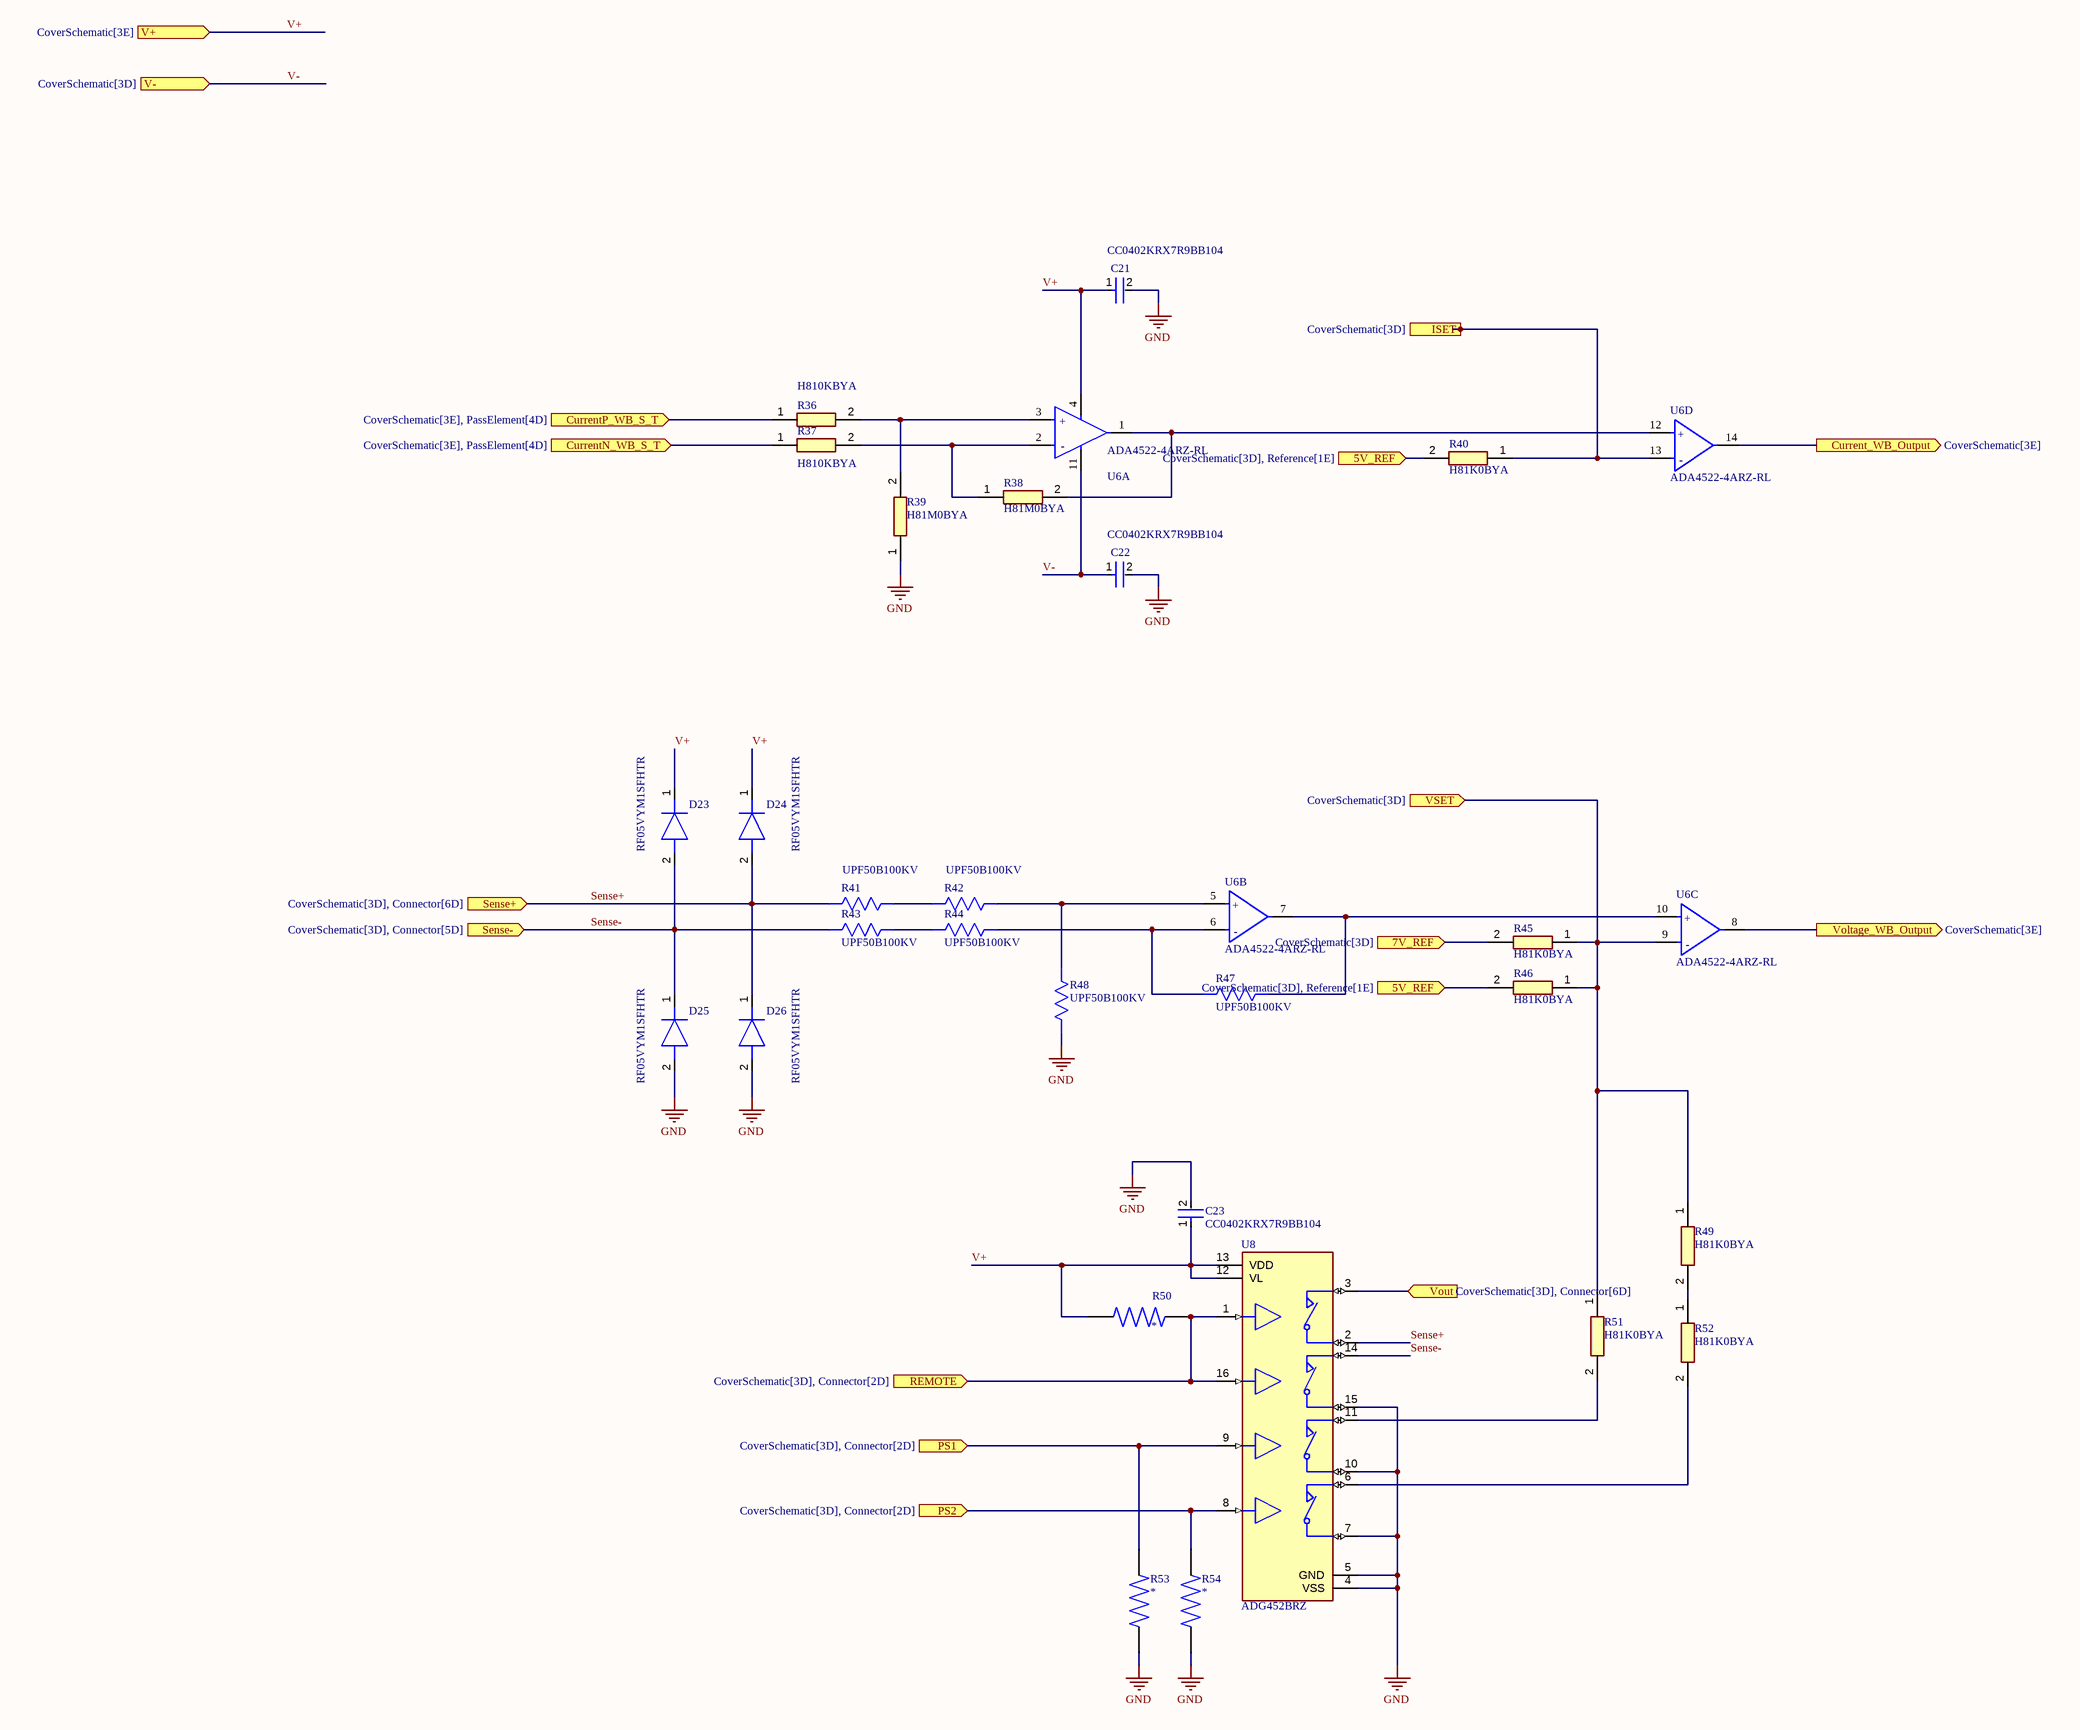
[diagram p5: TempEnhanced.SchDoc]

### Parts
C21  CC0402KRX7R9BB104  [FP-CC0402-MFG]
C22  CC0402KRX7R9BB104  [FP-CC0402-MFG]
C23  CC0402KRX7R9BB104  [FP-CC0402-MFG]
D23  RF05VYM1SFHTR  [RF05VYM1SFHTR]
D24  RF05VYM1SFHTR  [RF05VYM1SFHTR]
D25  RF05VYM1SFHTR  [RF05VYM1SFHTR]
D26  RF05VYM1SFHTR  [RF05VYM1SFHTR]
R36  H810KBYA  [RESAD1690W60L710D245]
R37  H810KBYA  [RESAD1690W60L710D245]
R38  H81M0BYA  [RESAD1690W60L710D245]
R39  H81M0BYA  [RESAD1690W60L710D245]
R40  H81K0BYA  [RESAD1690W60L710D245]
R41  UPF50B100KV  [RES_UPF50B2K0V_TEC]
R42  UPF50B100KV  [RES_UPF50B2K0V_TEC]
R43  UPF50B100KV  [RES_UPF50B2K0V_TEC]
R44  UPF50B100KV  [RES_UPF50B2K0V_TEC]
R45  H81K0BYA  [RESAD1690W60L710D245]
R46  H81K0BYA  [RESAD1690W60L710D245]
R47  UPF50B100KV  [RES_UPF50B2K0V_TEC]
R48  UPF50B100KV  [RES_UPF50B2K0V_TEC]
R49  H81K0BYA  [RESAD1690W60L710D245]
R50  MCT06030C1001FP500  [RESC1508X55N]  (value not drawn)
R51  H81K0BYA  [RESAD1690W60L710D245]
R52  H81K0BYA  [RESAD1690W60L710D245]
R53  MCT06030C1001FP500  [RESC1508X55N]  (value not drawn)
R54  MCT06030C1001FP500  [RESC1508X55N]  (value not drawn)
U6  ADA4522-4ARZ-RL  [FP-R-14-IPC_C]  (parts A,B,C,D of 4)
U8  ADG452BRZ  [FP-R-16-IPC_B]

### Ports
5V_REF (in, see CoverSchematic[3D], Reference[1E]), 7V_REF (in, see CoverSchematic[3D]), Current_WB_Output (out, see CoverSchematic[3E]), CurrentN_WB_S_T (in, see CoverSchematic[3E], PassElement[4D]), CurrentP_WB_S_T (in, see CoverSchematic[3E], PassElement[4D]), ISET (in, see CoverSchematic[3D]), PS1 (in, see CoverSchematic[3D], Connector[2D]), PS2 (in, see CoverSchematic[3D], Connector[2D]), REMOTE (in, see CoverSchematic[3D], Connector[2D]), Sense+ (in, see CoverSchematic[3D], Connector[6D]), Sense- (in, see CoverSchematic[3D], Connector[5D]), V+ (in, see CoverSchematic[3E]), V- (in, see CoverSchematic[3D]), Voltage_WB_Output (out, see CoverSchematic[3E]), Vout (in, see CoverSchematic[3D], Connector[6D]), VSET (in, see CoverSchematic[3D])

### Nets
GND: C21.2 C22.2 C23.2 D25.2(A) D26.2(A) R39.1 R48.2 R53.1 R54.1 U8.4(VSS) U8.5(GND) U8.7(D4) U8.10(D3) U8.15(D2)
5V_REF: R40.2 R46.2 ; port 5V_REF
7V_REF: R45.2 ; port 7V_REF
Current_WB_Output: U6.14(OUT_D) ; port Current_WB_Output
CurrentN_WB_S_T: R37.1 ; port CurrentN_WB_S_T
CurrentP_WB_S_T: R36.1 ; port CurrentP_WB_S_T
ISET: R40.1 U6.13(-IN_D) ; port ISET
PS1: R53.2 U8.9(IN3) ; port PS1
PS2: R54.2 U8.8(IN4) ; port PS2
REMOTE: R50.2 U8.1(IN1) U8.16(IN2) ; port REMOTE
Sense+: D24.2(A) D26.1(K) R41.2 U8.2(D1) ; port Sense+
Sense-: D23.2(A) D25.1(K) R43.2 U8.14(S2) ; port Sense-
V+: C21.1 C23.1 D23.1(K) D24.1(K) R50.1 U6.4(V+) U8.12(VL) U8.13(VDD) ; port V+
V-: C22.1 U6.11(V-) ; port V-
Voltage_WB_Output: U6.8(OUT_C) ; port Voltage_WB_Output
Vout: U8.3(S1) ; port Vout
VSET: R45.1 R46.1 R49.1 R51.1 U6.9(-IN_C) ; port VSET
NetR36_2: R36.2 R39.2 U6.3(+IN_A)
NetR37_2: R37.2 R38.1 U6.2(-IN_A)
NetR38_2: R38.2 U6.1(OUT_A) U6.12(+IN_D)
NetR41_1: R41.1 R42.2
NetR42_1: R42.1 R48.1 U6.5(+IN_B)
NetR43_1: R43.1 R44.2
NetR44_1: R44.1 R47.2 U6.6(-IN_B)
NetR47_1: R47.1 U6.7(OUT_B) U6.10(+IN_C)
NetR49_2: R49.2 R52.1
NetR51_2: R51.2 U8.11(S3)
NetR52_2: R52.2 U8.6(S4)

### Channels
Temperature_Enhanced_WB1: designators end in _Temperature_Enhanced_WB1; ports 5V_REF=NetAmph_7 7V_REF=NetAmph_5 Current_WB_Output=NetR13_1 CurrentN_WB_S_T=NetQ7_4 CurrentP_WB_S_T=NetQ6_3 ISET=NetJ1_5 PS1=NetJ1_21 PS2=NetJ1_22 REMOTE=NetJ1_20 Sense+=Sense+ Sense-=Sense- V+=V+ V-=V- Voltage_WB_Output=NetR14_2 Vout=NetC3_2 VSET=NetJ1_3
Temperature_Enhanced_WB2: designators end in _Temperature_Enhanced_WB2; ports 5V_REF=NetAmph_7 7V_REF=NetAmph_5 Current_WB_Output=NetR5_1 CurrentN_WB_S_T=NetQ5_4 CurrentP_WB_S_T=NetQ1_3 ISET=NetJ1_5 PS1=NetJ1_21 PS2=NetJ1_22 REMOTE=NetJ1_20 Sense+=Sense+ Sense-=Sense- V+=V+ V-=V- Voltage_WB_Output=NetR6_2 Vout=NetC3_2 VSET=NetJ1_3

### Notes on the sheet
- DWG. NO.
- REV.
- SHT.
- REVISION
- DESCRIPTION
- DATE
- APPROVED
- THIS DOCUMENT AND THE DATA DISCLOSED HEREIN OR HEREWITH IS THE PROPERTY OF ALTIUM LIMITED AND MAY BE FREELY DISTRIBUTED IN WHOLE. NO RIGHTS ARE RESERVED OR EXPRESS OR IMPLIED WARANTEE GIVEN.
- PROJECT
- TITLE
- SCALE:
- C
- SIZE
- CAGE CODE
- FILE NAME
- DWG by:
- Heitor Sampaio Mendes
- SHEET
- OF
- REV
- (in symbol CMP-09116-000280-1, part A) +; -
- (in symbol CMP-09116-000280-1, part B) +; -
- (in symbol CMP-09116-000280-1, part C) +; -
- (in symbol CMP-09116-000280-1, part D) +; -

### Library data of the parts
C21-C23 = CMP-03422-001010-1: CAP CER 0.1UF 50V X7R 0402; Manufacturer: YAGEO; Capacitance: 100 nF; Temperature Coefficient: 30ppm/°C; Material: Ceramic; Value: 100 nF; Automotive Grade: NA; Tolerance: 0.1; Footprint Url: http://www.yageo.com/exep/pages/download/literatures/UPY-C_GEN_24.pdf; Category: Cap; Package: CC0402; Voltage Rating: 50 V; ComponentLink2Description: Datasheet; Temperature Characteristic: X7R; Device Class L1: Passive Components; Device Class L2: Capacitors; Digikey Description: CAP CER 0.1UF 50V X7R 0402; Octopart: https://octopart.com/cc0402krx7r9bb104-yageo-56536067; Device Class L3: Ceramic Capacitors; Height: 0.55mm; Temperature: -55°C to +125°C; Temperature Range High: +125°C; ComponentLink2URL: http://www.yageo.com/documents/recent/UPY-GP_NP0_16V-to-50V_16.pdf; Temperature Range Low: -55°C; RoHS: TRUE; Ipc Land Pattern Name: CAPC10050X50; Lead Free: Yes; Automotive: No; Manufacturer Part Number: CC0402KRX7R9BB104
D23-D26 = RF05VYM1SFHTR: as D9 on sheet Reference; Datasheet Link: https://fscdn.rohm.com/en/products/databook/datasheet/discrete/diode/fast_recovery/rf05vym1sfh.pdf; Height: 0.8mm; Manufacturer_Part_Number: RF05VYM1SFHTR; Mouser Part Number: 755-RF05VYM1SFHTR; Mouser Price/Stock: https://www.mouser.co.uk/ProductDetail/ROHM-Semiconductor/RF05VYM1SFHTR?qs=4v%252BiZTmLVHEBI5apodawUw%3D%3D
R36-R40 R45 R46 R49 R51 R52 = H810KBYA: Resistor; Manufacturer_Name: TE Connectivity; Datasheet Link: https://datasheet.datasheetarchive.com/originals/distributors/DKDS-21/401710.pdf; Manufacturer_Part_Number: H810KBYA; Mouser Part Number: 279-H810KBYA; Mouser Price/Stock: https://www.mouser.com/Search/Refine.aspx?Keyword=279-H810KBYA; Arrow Part Number: H810KBYA; Arrow Price/Stock: https://www.arrow.com/en/products/h810kbya/te-connectivity
R41-R44 R47 R48 = UPF50B100RV: as R25 on sheet Reference
R50 R53 R54 = MCT06030C1001FP500: as R5 on sheet PassElement; Value: *; Package: None; Price: None; MP: MCT06030C1001FP500; Availability: Unavailable
U6 = CMP-09116-000280-1: as U4 on sheet Reference; Max Operating Temperature: 125°C; Number of Pins: 14; Case/Package: SOIC; RoHS Compliant: Yes; Packaging: Tape and Reel; Min Operating Temperature: -40°C; Contact Plating: Tin; Lead Free: Contains Lead; Mount: Surface Mount
U8 = CMP-09113-000001-1: IC SWITCH QUAD SPST 16SOIC; Manufacturer: Analog Devices; Standoff Height: 0.1mm; Max Junction Temp: +150°C; Nominal Supply Current: 0.0001uA; On State Resistance: 4-7Ω; Number Of Circuits: 4; Min Supply Voltage: 5V; Throw Configuration: SPST-NO; Mux Demux Ratio: 1:1; Max Supply Voltage: 12V; Device Class L3: Analog Switches; Lead Free: Yes; Manufacturer Part Number: ADG452BRZ; Device Class L2: Interface ICs; Category: IC; Temperature Range Low: -40°C; Temperature Range High: +85°C; Device Class L1: Integrated Circuits (ICs); ComponentLink2URL: https://www.analog.com/media/en/technical-documentation/data-sheets/ADG451_452_453.pdf; Footprint Url: https://www.analog.com/media/en/package-pcb-resources/package/pkg_pdf/soic_narrow-r/r_16.pdf; Octopart: https://octopart.com/adg452brz-analog+devices-512739; Automotive: No; Package: R-16; RoHS: TRUE; Digikey Description: IC SWITCH QUAD SPST 16SOIC; ComponentLink2Description: Datasheet; Height: 1.75mm; Temperature: -40°C to +85°C; Mouser Description: Analog Switch ICs LC2MOS 5 Ohm SPST

## Sheet SolidStateDosimeter.SchDoc
size 431 x 279 mm; SheetNumber: 6; SheetTotal: 8
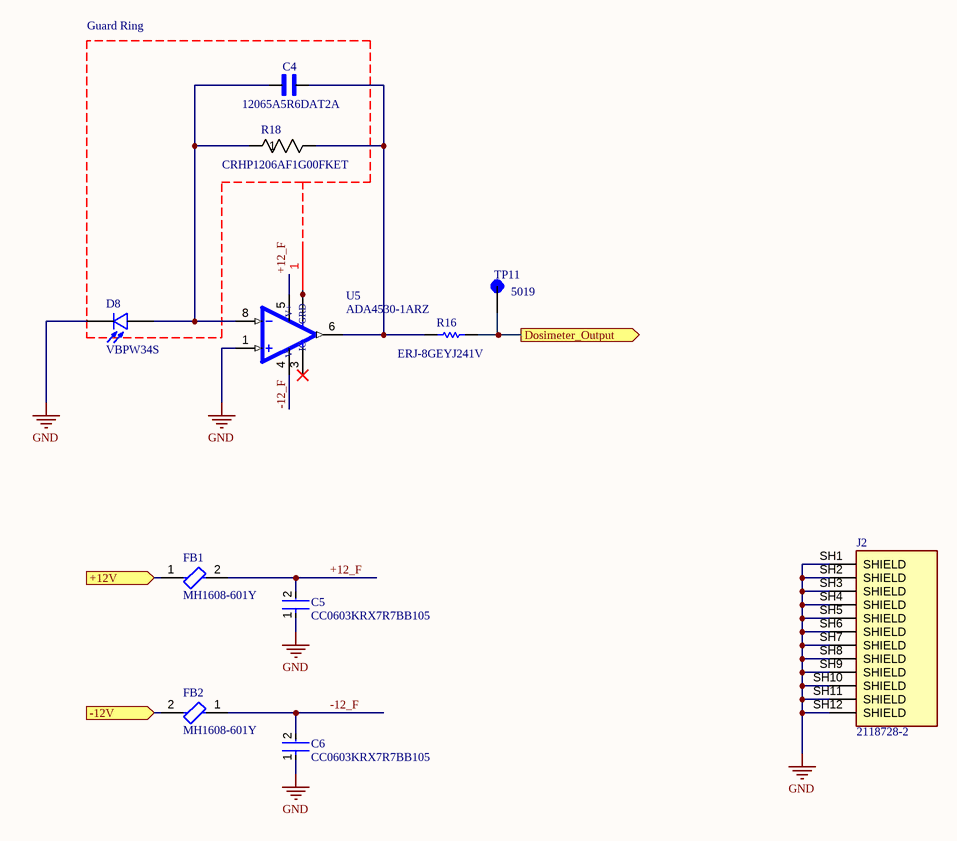
[diagram p6: SolidStateDosimeter.SchDoc]

### Parts
C4  12065A5R6DAT2A  [CAPC3216X94N]
C5  CC0603KRX7R7BB105  [FP-CC0603-DA-MFG]
C6  CC0603KRX7R7BB105  [FP-CC0603-DA-MFG]
D8  VBPW34S  [XDCR_VBPW34S]
FB1  MH1608-601Y  [FP-MH1608-MFG]
FB2  MH1608-601Y  [FP-MH1608-MFG]
GR  GUARD_RING  [Guard]  (value not drawn)
J2  2118728-2  [TE_2118728-2]
R16  ERJ-8GEYJ241V  [RESC3216X70X50NL05T20]
R18  CRHP1206AF1G00FKET  [RES_CRHP1206_VIS]
TP11  5019  [KEYSTONE_5019]
U5  ADA4530-1ARZ  [SOIC127P600X175-8N]

### Ports
+12V (in, see CoverSchematic[6C], Lownoise_auxReg[4D], Reference[9F], TemperatureMon[5D], TemperatureMon[6E], TemperatureMon[8D]), -12V (in, see CoverSchematic[6C], Lownoise_auxReg[4C], PassElement[4C], PassElement[4E], PassElement[4F], TemperatureMon[3D], TemperatureMon[3E], TemperatureMon[6D]), Dosimeter_Output (out, see CoverSchematic[5C])

### Nets
GND: C5.1 C6.1 D8.K(C) J2.SH1(SHIELD) J2.SH2(SHIELD) J2.SH3(SHIELD) J2.SH4(SHIELD) J2.SH5(SHIELD) J2.SH6(SHIELD) J2.SH7(SHIELD) J2.SH8(SHIELD) J2.SH9(SHIELD) J2.SH10(SHIELD) J2.SH11(SHIELD) J2.SH12(SHIELD) U5.1(+IN)
+12_F: C5.2 FB1.2 U5.5(V+)
-12_F: C6.2 FB2.1 U5.4(V-)
V-: FB2.2 ; port -12V
NetC4_1: C4.1 D8.A R18.1 U5.8(-IN)
NetC4_2: C4.2 R16.1 R18.2 U5.6(OUT)
NetC7_2: FB1.1 ; port +12V
NetGR_1: GR.1 U5.2(GRD) U5.7(GRD)
NetJ1_24: R16.2 TP11.TP ; port Dosimeter_Output

Not connected (* = marked no-connect by the designer): U5 3(IC)*

### Notes on the sheet
- DWG. NO.
- REV.
- SHT.
- THIS DOCUMENT AND THE DATA DISCLOSED HEREIN OR HEREWITH IS THE PROPERTY OF ALTIUM LIMITED AND MAY BE FREELY DISTRIBUTED IN WHOLE. NO RIGHTS ARE RESERVED OR EXPRESS OR IMPLIED WARANTEE GIVEN.
- REVISION
- DESCRIPTION
- DATE
- APPROVED
- TITLE
- PROJECT
- SCALE:
- B
- SIZE
- CAGE CODE
- FILE NAME
- DWG by:
- Heitor Sampaio Mendes
- SHEET
- OF
- REV
- (in symbol Component_1) Guard Ring

### Library data of the parts
C4 = 12065A5R6DAT2A: CAP CER 5.6PF 50V C0G/NP0 1206; MF: {'manufacturer': u'AVX'}; Package: None; Price: None; Value: *; MP: 12065A5R6DAT2A; Availability: Unavailable
C5 C6 = CMP-03422-000924-1: CAP CER 1UF 16V X7R 0603; Manufacturer: YAGEO; Tolerance: 0.1; Temperature Coefficient: 15%; Material: Ceramic; Package: CC0603-DA; RoHS: TRUE; Device Class L2: Capacitors; Temperature Characteristic: X7R; Temperature: -55°C to +125°C; Temperature Range Low: -55°C; Automotive: No; ComponentLink2Description: Datasheet; Value: 1 uF; Lead Free: Yes; Capacitance: 1 uF; ComponentLink2URL: http://www.yageo.com/documents/recent/UPY-GPHC_X7R_6.3V-to-50V_18.pdf; Device Class L1: Passive Components; Voltage: 16 V; Octopart: https://octopart.com/cc0603krx7r7bb105-yageo-42271928; Category: Cap; Digikey Description: CAP CER 1UF 16V X7R 0603; Footprint Url: http://www.yageo.com/exep/pages/download/literatures/UPY-C_GEN_24.pdf; Height: 0.9mm; Manufacturer Part Number: CC0603KRX7R7BB105; Voltage Rating: 16 V; Temperature Range High: +125°C; Mouser Description: Multilayer Ceramic Capacitor, CC Series, 1 - F, - 10%, X7R, 16 V, 0603 [1608 Metric]; Device Class L3: Ceramic Capacitors
D8 = VBPW34S: VBPW34SR Series 60 V 940 nm 50 mA 215 mW Surface Mount Silicon PIN Photodiode; MF: {'manufacturer': u'Vishay'}; Package: None; Price: None; Value: *; MP: VBPW34S; Availability: Unavailable
FB1 FB2 = CMP-2000-06698-2: FERRITE BEAD 600 OHM 0603 1LN; Tolerance: 25%; Max DC Current: 1A; Test Frequency: 100MHz; Current Rating: 3A; Number of Lines: 1; DC Resistance (DCR): 25mR; Impedance: 600R; Case/Package: 0603; Packaging: Tape and Reel; Case Code (Imperial): 0603; Radiation Hardening: No; Package Quantity: 1; Height: 0.039inch; Width: 0.031inch; Series: MH; REACH SVHC: No SVHC; Depth: 1mm; Min Operating Temperature: -55°C; Length: 0.063inch; Case Code (Metric): 1608; Termination: SMD/SMT; RoHS Compliant: Yes; DC Current: 1A; Max Current Rating: 1A; Core Material: Ferrite; Mount: Surface Mount; Military Standard: Not; Max Operating Temperature: 125°C
GR = Component_1
J2 = 2118728-2: MF: {'manufacturer': u'TE Connectivity'}; Package: None; Price: None; Value: *; MP: 2118728-2; Availability: Unavailable
R16 = CMP-2003-00592-1: Manufacturer: Panasonic; Part Number: ERJ-8GEYJ241V
R18 = CRHP1206AF1G00FKET: No Description Available; Mfr_Name: Vishay
TP11 = 5019: as TP9 on sheet PassElement; Package: None; Price: None; Value: *; MP: 5019; Availability: Unavailable
U5 = ADA4530-1ARZ: MF: {'manufacturer': u'Analog Devices'}; Package: None; Price: None; Value: *; MP: ADA4530-1ARZ; Availability: Unavailable

## Sheet TemperatureMon.SchDoc
size 431 x 279 mm; SheetNumber: 7; SheetTotal: 8
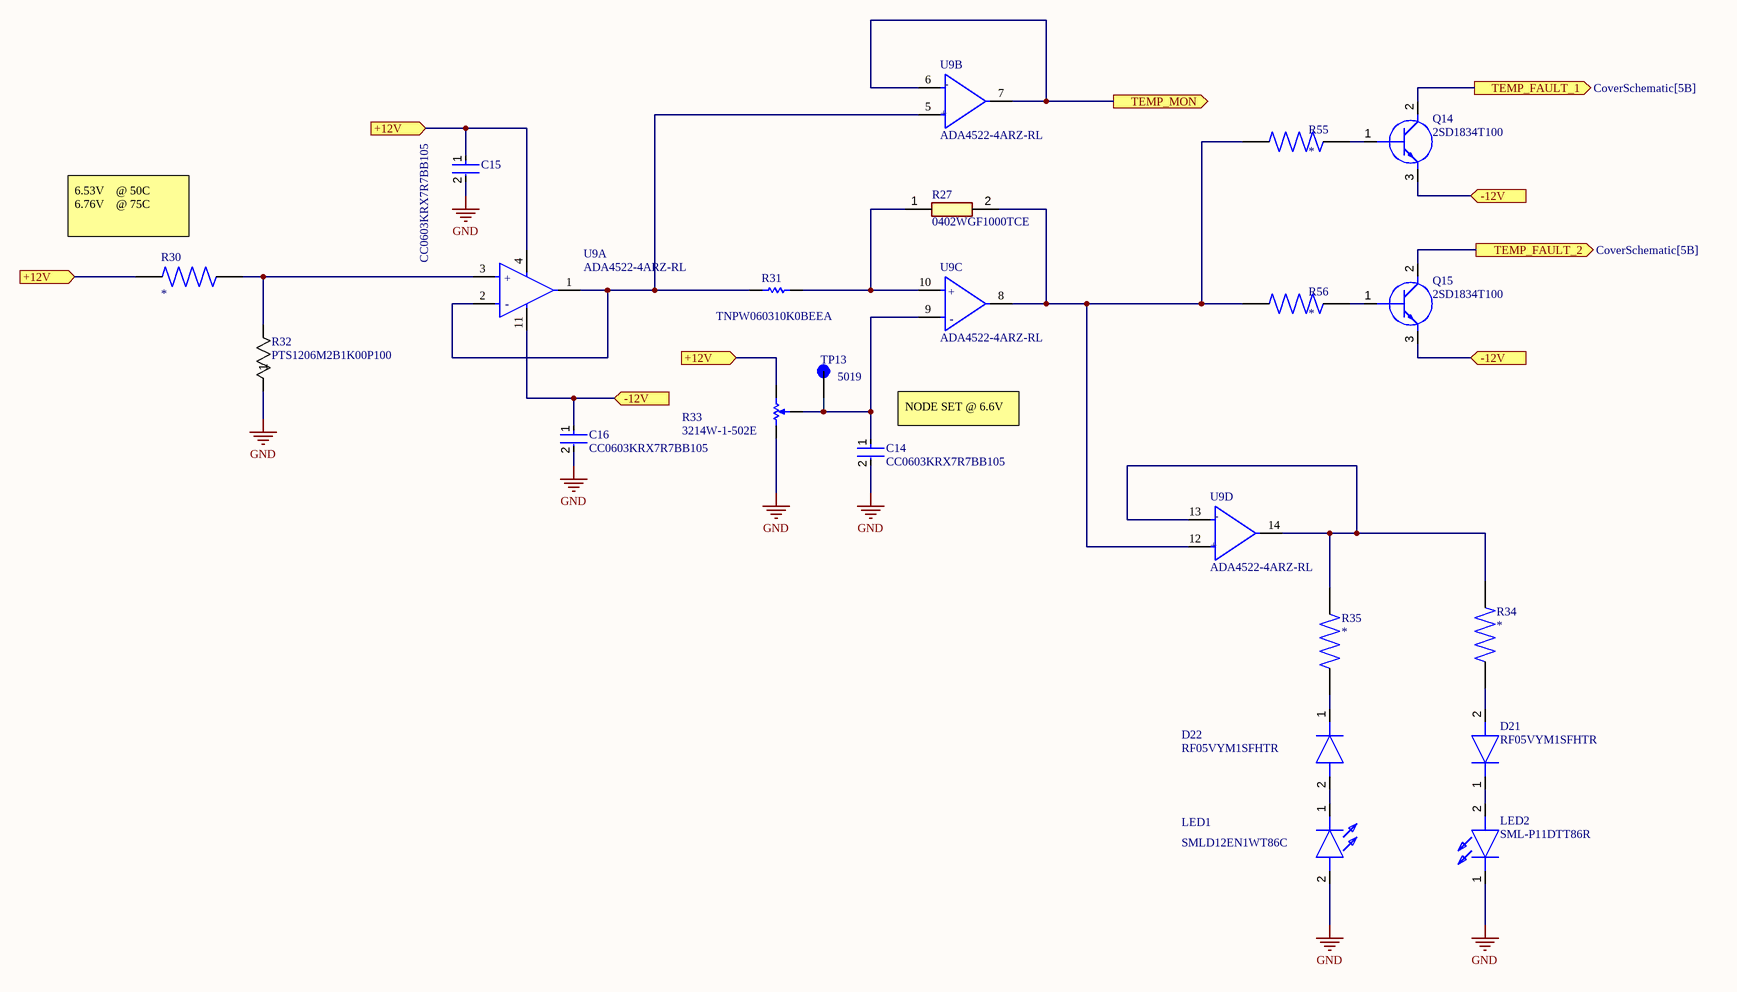
[diagram p7: TemperatureMon.SchDoc]

### Parts
C14  CC0603KRX7R7BB105  [FP-CC0603-DA-MFG]
C15  CC0603KRX7R7BB105  [FP-CC0603-DA-MFG]
C16  CC0603KRX7R7BB105  [FP-CC0603-DA-MFG]
D21  RF05VYM1SFHTR  [RF05VYM1SFHTR]
D22  RF05VYM1SFHTR  [RF05VYM1SFHTR]
LED1  SMLD12EN1WT86C  [SMLD12EN1WT86C]
LED2  SML-P11DTT86R  [SML-P11(1X0.6)]
Q14  2SD1834T100  [RJP020N06]
Q15  2SD1834T100  [RJP020N06]
R27  0402WGF1000TCE  [RESC1005X40N]
R30  MCT06030C1001FP500  [RESC1508X55N]  (value not drawn)
R31  TNPW060310K0BEEA  [RESC1609X55X30NL10T20]
R32  PTS1206M2B1K00P100  [PTS 1206_VIS]
R33  3214W-1-502E  [BOUR-3214W_V]
R34  MCT06030C1001FP500  [RESC1508X55N]  (value not drawn)
R35  MCT06030C1001FP500  [RESC1508X55N]  (value not drawn)
R55  MCT06030C1001FP500  [RESC1508X55N]  (value not drawn)
R56  MCT06030C1001FP500  [RESC1508X55N]  (value not drawn)
TP13  5019  [KEYSTONE_5019]
U9  ADA4522-4ARZ-RL  [FP-R-14-IPC_C]  (parts A,B,C,D of 4)

### Ports
+12V (in, see CoverSchematic[6B], Lownoise_auxReg[4D], Reference[9F], SolidStateDosimeter[5C]), -12V (in, see CoverSchematic[6B], Lownoise_auxReg[4C], PassElement[4C], PassElement[4E], PassElement[4F], SolidStateDosimeter[5B]), TEMP_FAULT_1 (out, see CoverSchematic[5B]), TEMP_FAULT_2 (out, see CoverSchematic[5B]), TEMP_MON (out, see CoverSchematic[5B], Connector[2D])

### Nets
GND: C14.2 C15.2 C16.2 LED1.2(A) LED2.1(K) R32.1 R33.1
V-: C16.1 Q14.3(E) Q15.3(E) U9.11(V-) ; port -12V
NetC7_2: C15.1 R30.2 R33.3 U9.4(V+) ; port +12V
NetC14_1: C14.1 R33.2 TP13.TP U9.9(-IN_C)
NetD1_1: Q14.2(C) ; port TEMP_FAULT_1
NetD5_1: Q15.2(C) ; port TEMP_FAULT_2
NetD21_1: D21.1(K) LED2.2(A)
NetD21_2: D21.2(A) R34.2
NetD22_1: D22.1(K) R35.2
NetD22_2: D22.2(A) LED1.1(K)
NetJ1_25: U9.6(-IN_B) U9.7(OUT_B) ; port TEMP_MON
NetQ14_1: Q14.1(B) R55.2
NetQ15_1: Q15.1(B) R56.2
NetR27_1: R27.1 R31.2 U9.10(+IN_C)
NetR27_2: R27.2 R55.1 R56.1 U9.8(OUT_C) U9.12(+IN_D)
NetR30_1: R30.1 R32.2 U9.3(+IN_A)
NetR31_1: R31.1 U9.1(OUT_A) U9.2(-IN_A) U9.5(+IN_B)
NetR34_1: R34.1 R35.1 U9.13(-IN_D) U9.14(OUT_D)

### Notes on the sheet
- (near R30) 6.53V    @ 50C
  6.76V    @ 75C
- (near C14) NODE SET @ 6.6V
- DWG. NO.
- REV.
- SHT.
- THIS DOCUMENT AND THE DATA DISCLOSED HEREIN OR HEREWITH IS THE PROPERTY OF ALTIUM LIMITED AND MAY BE FREELY DISTRIBUTED IN WHOLE. NO RIGHTS ARE RESERVED OR EXPRESS OR IMPLIED WARANTEE GIVEN.
- REVISION
- DESCRIPTION
- DATE
- APPROVED
- TITLE
- PROJECT
- SCALE:
- B
- SIZE
- CAGE CODE
- FILE NAME
- DWG by:
- Heitor Sampaio Mendes
- SHEET
- OF
- REV
- (in symbol CMP-09116-000280-1, part A) +; -
- (in symbol CMP-09116-000280-1, part B) -; +
- (in symbol CMP-09116-000280-1, part C) +; -
- (in symbol CMP-09116-000280-1, part D) -; +

### Library data of the parts
C14-C16 = CMP-03422-000924-1: as C5 on sheet SolidStateDosimeter; Package: CC0603-DA; RoHS: TRUE; Device Class L2: Capacitors; Temperature Characteristic: X7R; Temperature: -55°C to +125°C; Temperature Range Low: -55°C; Automotive: No; ComponentLink2Description: Datasheet; Value: 1 uF; Lead Free: Yes; Capacitance: 1 uF; ComponentLink2URL: http://www.yageo.com/documents/recent/UPY-GPHC_X7R_6.3V-to-50V_18.pdf; Device Class L1: Passive Components; Voltage: 16 V; Octopart: https://octopart.com/cc0603krx7r7bb105-yageo-42271928; Category: Cap; Digikey Description: CAP CER 1UF 16V X7R 0603; Footprint Url: http://www.yageo.com/exep/pages/download/literatures/UPY-C_GEN_24.pdf; Height: 0.9mm; Manufacturer Part Number: CC0603KRX7R7BB105; Voltage Rating: 16 V; Temperature Range High: +125°C; Mouser Description: Multilayer Ceramic Capacitor, CC Series, 1 - F, - 10%, X7R, 16 V, 0603 [1608 Metric]; Device Class L3: Ceramic Capacitors
D21 D22 = RF05VYM1SFHTR: as D9 on sheet Reference; Datasheet Link: https://fscdn.rohm.com/en/products/databook/datasheet/discrete/diode/fast_recovery/rf05vym1sfh.pdf; Height: 0.8mm; Manufacturer_Part_Number: RF05VYM1SFHTR; Mouser Part Number: 755-RF05VYM1SFHTR; Mouser Price/Stock: https://www.mouser.co.uk/ProductDetail/ROHM-Semiconductor/RF05VYM1SFHTR?qs=4v%252BiZTmLVHEBI5apodawUw%3D%3D
LED1 = SMLD12EN1WT86C: LED; Manufacturer_Name: ROHM Semiconductor; Datasheet Link: https://fscdn.rohm.com/en/products/databook/datasheet/opto/led/chip_mono/smld12en1wt86(c)-e.pdf; Height: 0.65mm; Manufacturer_Part_Number: SMLD12EN1WT86C; Mouser Part Number: 755-SMLD12EN1WT86C; Mouser Price/Stock: https://www.mouser.co.uk/ProductDetail/ROHM-Semiconductor/SMLD12EN1WT86C?qs=Z%252BL2brAPG1KJHKBIKSy7wg%3D%3D
LED2 = SML-P11DTT86R: LED; Manufacturer_Name: ROHM Semiconductor; Datasheet Link: https://componentsearchengine.com/Datasheets/2/SML-P11DTT86R.pdf; Manufacturer_Part_Number: SML-P11DTT86R; Mouser Part Number: 755-SML-P11DTT86R; Mouser Price/Stock: https://www.mouser.co.uk/ProductDetail/ROHM-Semiconductor/SML-P11DTT86R?qs=Ei%2Fnxee9QYgth7PNBqfe%252BA%3D%3D
Q14 Q15 = 2SD1834T100: as Q2 on sheet PassElement; Datasheet Link: https://fscdn.rohm.com/en/products/databook/datasheet/discrete/transistor/bipolar/2sd1834t100-e.pdf; Height: 1.45mm; Manufacturer_Part_Number: 2SD1834T100; Mouser Part Number: 755-2SD1834T100; Mouser Price/Stock: https://www.mouser.co.uk/ProductDetail/ROHM-Semiconductor/2SD1834T100?qs=4kLU8WoGk0vMh1jN%252BYQmXQ%3D%3D
R27 = 0402WGF1000TCE: Resistor; Manufacturer_Name: UNI-ROYAL(Uniroyal Elec); Datasheet Link: https://datasheet.lcsc.com/szlcsc/Uniroyal-Elec-0402WGF1000TCE_C25076.pdf; Height: 0.4mm; Manufacturer_Part_Number: 0402WGF1000TCE
R30 R34 R35 R55 R56 = MCT06030C1001FP500: as R5 on sheet PassElement; Value: *; Package: None; Price: None; MP: MCT06030C1001FP500; Availability: Unavailable
R31 = CMP-2000-03691-1: Manufacturer: Vishay Dale; Part Number: TNPW060310K0BEEA
R32 = PTS1206M2B1K00P100: No Description Available; Mfr_Name: Vishay
R33 = CMP-2000-05579-1: 3214 - 5-Turn Trimpot(R) Trimming Potentiometer, 5 KOhm, +/- 10%, 0.25 W, -65 to 150 degC, RoHS, Tape and Reel; Manufacturer: Bourns; Temperature Coefficient: ±100ppm/°C; Power Rating: 250mW; No. of Turns: 5; Track Resistance: 5kohm; SVHC: NoSVHC(16-Jun-2014); Potentiometer Mounting: SMD; Manufacturer URL: http://www.bourns.com/; Resistance Tolerance: ±10%; Datasheet URL: http://www.bourns.com/docs/Product-Datasheets/3214.pdf; ROHS COMPLIANT: Yes; Mounting Technology: SurfaceMount; Datasheet Version: 05/2016; Package Reference: 3214W; Package Description: 3-Pin Surface Mount Device, Body 3.5 x 4.8 mm, Pitch 1.25 mm
TP13 = 5019: as TP9 on sheet PassElement; Package: None; Price: None; Value: *; MP: 5019; Availability: Unavailable
U9 = CMP-09116-000280-1: as U4 on sheet Reference; Max Operating Temperature: 125°C; Number of Pins: 14; Case/Package: SOIC; RoHS Compliant: Yes; Packaging: Tape and Reel; Min Operating Temperature: -40°C; Contact Plating: Tin; Lead Free: Contains Lead; Mount: Surface Mount

## Sheet Lownoise_auxReg.SchDoc
size 431 x 279 mm; SheetNumber: 8; SheetTotal: 8
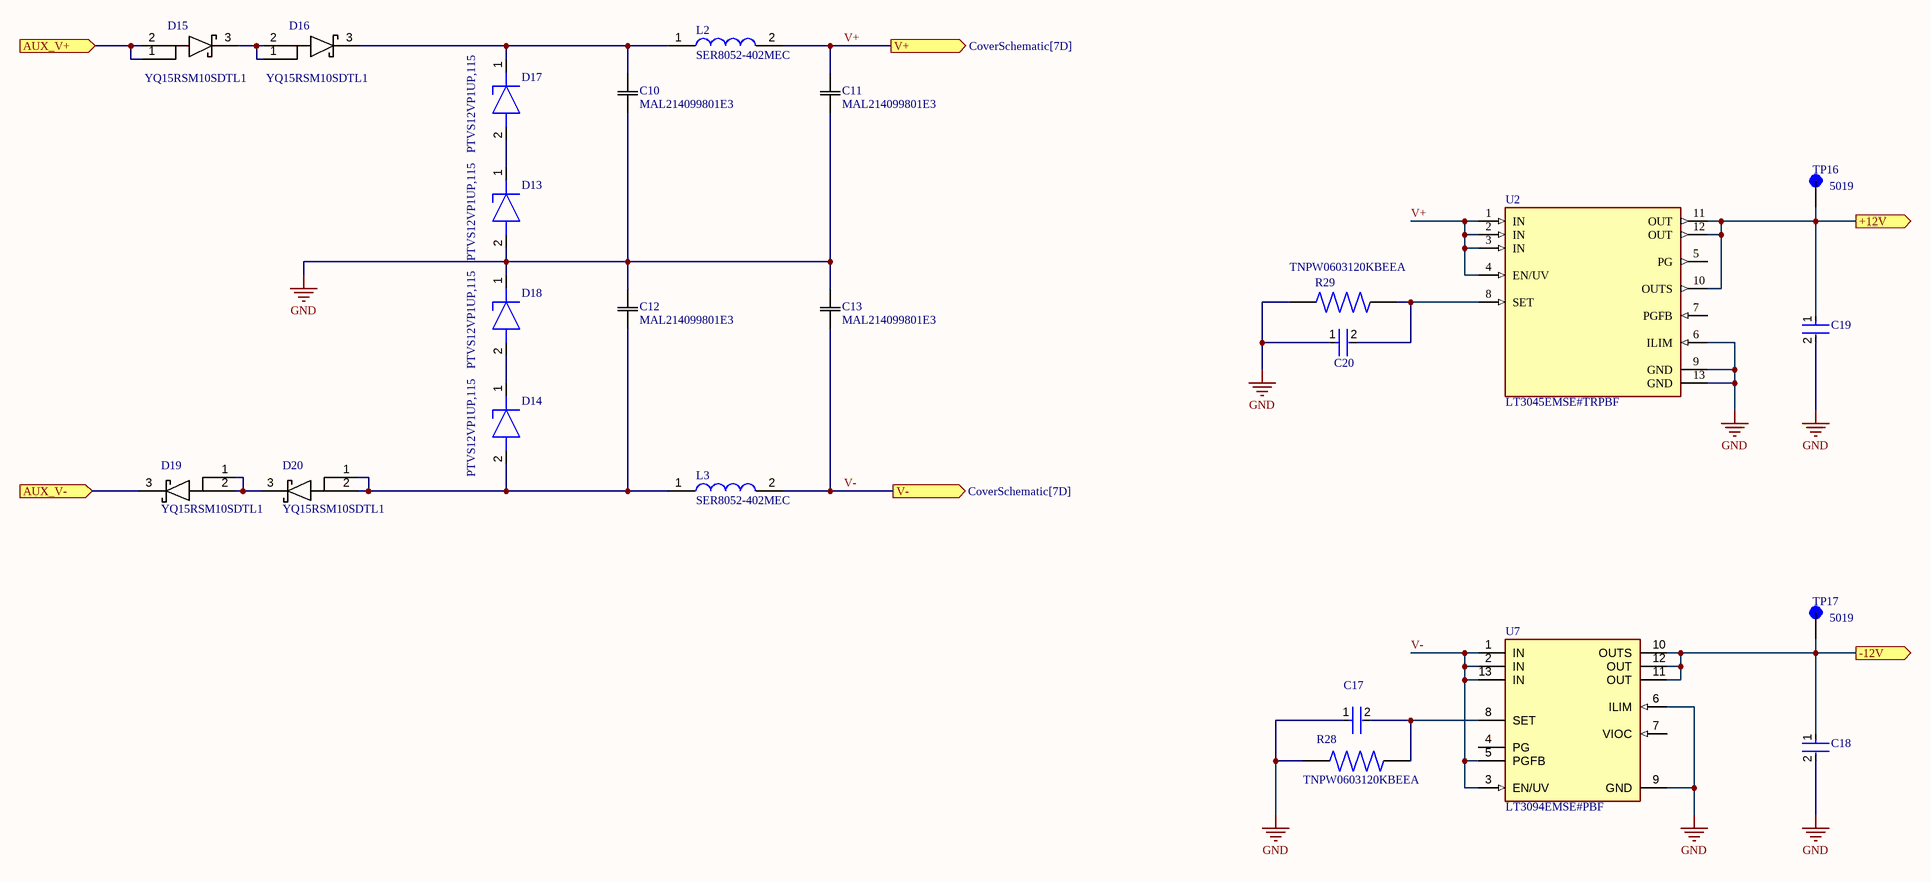
[diagram p8: Lownoise_auxReg.SchDoc]

### Parts
C10  MAL214099801E3  [CAP_140CRH_1010_VIS]
C11  MAL214099801E3  [CAP_140CRH_1010_VIS]
C12  MAL214099801E3  [CAP_140CRH_1010_VIS]
C13  MAL214099801E3  [CAP_140CRH_1010_VIS]
C17  GRM31CR71E106KA12L  [FP-GRM31C-0_2-e0_3_0_8-MFG]  (value not drawn)
C18  GRM31CR71E106KA12L  [FP-GRM31C-0_2-e0_3_0_8-MFG]  (value not drawn)
C19  GRM31CR71E106KA12L  [FP-GRM31C-0_2-e0_3_0_8-MFG]  (value not drawn)
C20  GRM31CR71E106KA12L  [FP-GRM31C-0_2-e0_3_0_8-MFG]  (value not drawn)
D13  PTVS12VP1UP,115  [PMEG3050EP115]
D14  PTVS12VP1UP,115  [PMEG3050EP115]
D15  YQ15RSM10SDTL1  [YQ15RSM10SDTL1]
D16  YQ15RSM10SDTL1  [YQ15RSM10SDTL1]
D17  PTVS12VP1UP,115  [PMEG3050EP115]
D18  PTVS12VP1UP,115  [PMEG3050EP115]
D19  YQ15RSM10SDTL1  [YQ15RSM10SDTL1]
D20  YQ15RSM10SDTL1  [YQ15RSM10SDTL1]
L2  SER8052-402MEC  [SER8052402MEC]
L3  SER8052-402MEC  [SER8052402MEC]
R28  TNPW0603120KBEEA  [RESC1508X55N]
R29  TNPW0603120KBEEA  [RESC1508X55N]
TP16  5019  [KEYSTONE_5019]
TP17  5019  [KEYSTONE_5019]
U2  LT3045EMSE#TRPBF  [FP-MSE-12-05-08-1666-IPC_B]
U7  LT3094EMSE#PBF  [FP-MSE-12-05-08-1666-MFG]

### Ports
+12V (out, see CoverSchematic[7D], Reference[9F], SolidStateDosimeter[5C], TemperatureMon[5D], TemperatureMon[6E], TemperatureMon[8D]), -12V (out, see CoverSchematic[6D], PassElement[4C], PassElement[4E], PassElement[4F], SolidStateDosimeter[5B], TemperatureMon[3D], TemperatureMon[3E], TemperatureMon[6D]), AUX_V+ (in, see CoverSchematic[7E]), AUX_V- (in, see CoverSchematic[6E]), V+ (out, see CoverSchematic[7D]), V- (out, see CoverSchematic[7D])

### Nets
GND: C10.1 C11.1 C12.2 C13.2 C17.1 C18.2 C19.2 C20.1 D13.2(A) D18.1(K) R28.1 R29.1 U2.6(ILIM) U2.9(GND) U2.13(GND) U7.6(ILIM) U7.9(GND)
V+: C11.2 L2.2 U2.1(IN) U2.2(IN) U2.3(IN) U2.4(EN/UV) ; port V+
V-: C18.1 TP17.TP U7.10(OUTS) U7.11(OUT) U7.12(OUT) ; port -12V
V-: C13.1 L3.2 U7.1(IN) U7.2(IN) U7.3(EN/UV) U7.5(PGFB) U7.13(IN) ; port V-  [a separate net that carries the same name]
NetC7_2: C19.1 TP16.TP U2.10(OUTS) U2.11(OUT) U2.12(OUT) ; port +12V
NetC10_2: C10.2 D16.3(K) D17.1(K) L2.1
NetC12_1: C12.1 D14.2(A) D20.1(A1) D20.2(A2) L3.1
NetC17_2: C17.2 R28.2 U7.8(SET)
NetC20_2: C20.2 R29.2 U2.8(SET)
NetD13_1: D13.1(K) D17.2(A)
NetD14_1: D14.1(K) D18.2(A)
NetD15_1: D15.1(A1) D15.2(A2) ; port AUX_V+
NetD15_3: D15.3(K) D16.1(A1) D16.2(A2)
NetD19_1: D19.1(A1) D19.2(A2) D20.3(K)
NetD19_3: D19.3(K) ; port AUX_V-

Not connected (* = marked no-connect by the designer): L2 3; L3 3; U2 5(PG) 7(PGFB); U7 4(PG) 7(VIOC)

### Notes on the sheet
- DWG. NO.
- REV.
- SHT.
- THIS DOCUMENT AND THE DATA DISCLOSED HEREIN OR HEREWITH IS THE PROPERTY OF ALTIUM LIMITED AND MAY BE FREELY DISTRIBUTED IN WHOLE. NO RIGHTS ARE RESERVED OR EXPRESS OR IMPLIED WARANTEE GIVEN.
- REVISION
- DESCRIPTION
- DATE
- APPROVED
- TITLE
- PROJECT
- SCALE:
- B
- SIZE
- CAGE CODE
- FILE NAME
- DWG by:
- Heitor Sampaio Mendes
- SHEET
- OF
- REV

### Library data of the parts
C10-C13 = MAL214099801E3: as C1 on sheet PassElement
C17-C20 = CMP-06035-003589-1: Chip Multilayer Ceramic Capacitors for General Purpose, 1206, 10uF, X7R, 15%, 10%, 25V; Case Code (Imperial): 1206; Voltage Rating (DC): 25V; Voltage Rating: 25V; Length: 3.2mm; Lead Free: Lead Free; Thickness: 0.071inch; Package Quantity: 1; Width: 1.6mm; Max Operating Temperature: 125°C; Number of Pins: 2; Height: 1.6mm; Case Code (Metric): 3216; REACH SVHC: No SVHC; Radiation Hardening: No; Case/Package: 1206; Material: Ceramic; Tolerance: 10%; Voltage: 25V; Mount: Surface Mount; Packaging: Tape and Reel; Dielectric: X7R; Termination: SMD/SMT; Min Operating Temperature: -55°C; Capacitance: 10uF; Depth: 1.6mm
D13 D14 D17 D18 = PTVS12VP1UP,115: as D1 on sheet PassElement; Datasheet Link: https://assets.nexperia.com/documents/data-sheet/PTVSXP1UP_SER.pdf; Height: 1mm; Manufacturer_Part_Number: PTVS12VP1UP,115; Mouser Part Number: 771-PTVS12VP1UP115; Mouser Price/Stock: https://www.mouser.co.uk/ProductDetail/Nexperia/PTVS12VP1UP115?qs=5eMHoInnifTeU9%2FVxPGuCA%3D%3D; Arrow Part Number: PTVS12VP1UP,115; Arrow Price/Stock: https://www.arrow.com/en/products/ptvs12vp1up115/nexperia
D15 D16 D19 D20 = YQ15RSM10SDTL1: as D3 on sheet PassElement; Datasheet Link: https://fscdn.rohm.com/en/products/databook/datasheet/discrete/diode/schottky_barrier/yq15rsm10sdtl1-e.pdf; Height: 1.2mm; Manufacturer_Part_Number: YQ15RSM10SDTL1; Mouser Part Number: 755-YQ15RSM10SDTL1; Mouser Price/Stock: https://www.mouser.co.uk/ProductDetail/ROHM-Semiconductor/YQ15RSM10SDTL1?qs=Z%252BL2brAPG1JP7erh913hZg%3D%3D
L2 L3 = SER8052-402MEC: Inductor; Manufacturer_Name: COILCRAFT; Datasheet Link: https://www.coilcraft.com/getmedia/f704c02a-b3a0-4aab-a2f9-03662c81c40d/ser80xx.pdf; Height: 5.2mm; Manufacturer_Part_Number: SER8052-402MEC; Mouser Part Number: 994-SER8052-402MEC; Mouser Price/Stock: https://www.mouser.co.uk/ProductDetail/Coilcraft/SER8052-402MEC?qs=mBwMfv9Clf3lT8OdMPOqNQ%3D%3D
R28 R29 = TNPW0603120KBEEA: MF: {'manufacturer': u'Vishay'}; Package: None; Price: None; Value: *; MP: TNPW0603120KBEEA; Availability: Unavailable
TP16 TP17 = 5019: as TP9 on sheet PassElement; Package: None; Price: None; Value: *; MP: 5019; Availability: Unavailable
U2 = CMP-09138-000053-1: IC REG LINEAR 0V 500MA 12MSOP; Case/Package: MSOP; RoHS Compliant: Yes
U7 = CMP-09138-000010-1: IC REG LIN NEG ADJ 500MA 12MSOP; Manufacturer: Analog Devices; Standoff Height: 0.0508mm; Number Of Outputs: 1; Min Supply Voltage: -20V; Max Junction Temp: +150°C; Output Voltage: 0/-12V; Dropout Voltage: 235mV; Output Type: AdjustableProgrammable; Nominal Supply Current: 3uA; Max Supply Voltage: -2.3V; Accuracy Percentage: 1%; Output Current: 100uA; Device Class L1: Integrated Circuits (ICs); Device Class L3: Voltage Regulators - Linear; Manufacturer Part Number: LT3094EMSE#PBF; Device Class L2: Power Management ICs; Ipc Land Pattern Name: SOP65P404X110-12; Mouser Description: LDO Regulator Neg 0V to -19.5V 0.5A 12-Pin MSOP EP Tube; Digikey Description: IC REG LIN NEG ADJ 500MA 12MSOP; Automotive: No; Temperature Range Low: -40°C; Temperature: -40°C to +125°C; ComponentLink2URL: https://www.analog.com/media/en/technical-documentation/data-sheets/LT3094.pdf; Temperature Range High: +125°C; RoHS: TRUE; Category: IC; ComponentLink2Description: Datasheet; Octopart: https://octopart.com/lt3094emse%23pbf-analog+devices-95403590; Package: MSE-12-05-08-1666; Lead Free: Yes; Height: 1.1mm